# Altium project PCB_Project.PrjPcb (part 1 of 2)
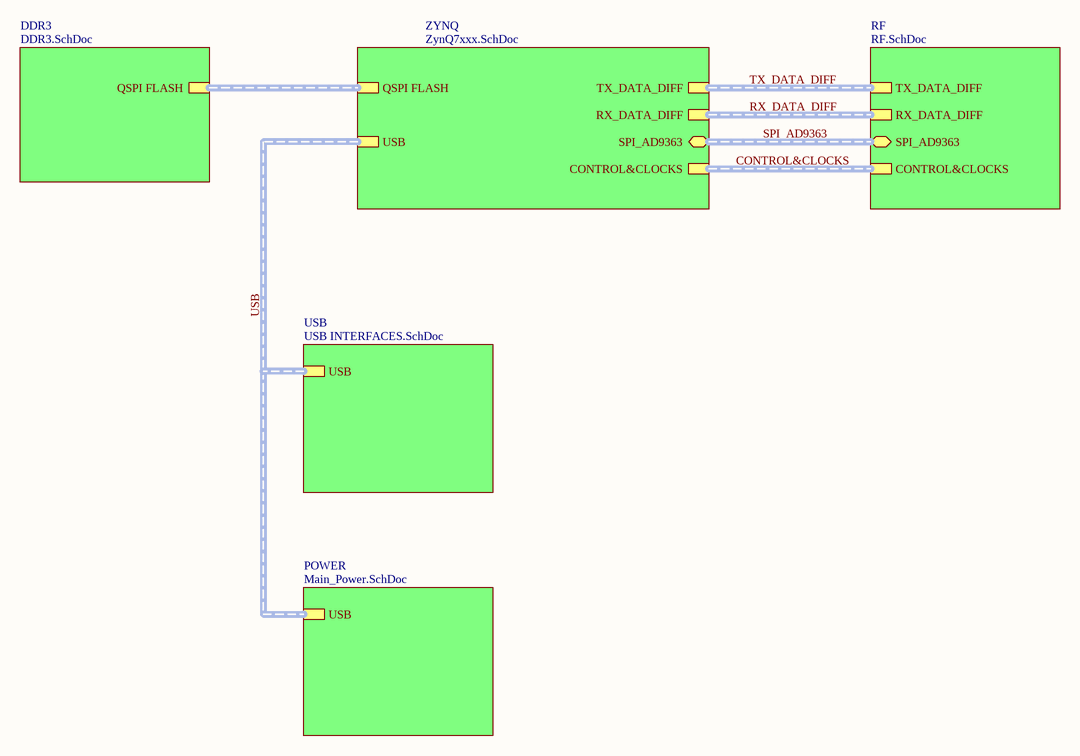
[diagram p0: TOP_Design.SchDoc]
6 sheets, 344 parts. Net scope: hierarchical (ports join the sheet entries above them; power ports are global).
Board file: SDR_CAMERA.PcbDoc
Sheets:
  TOP_Design.SchDoc
    ZYNQ = ZynQ7xxx.SchDoc
    DDR3 = DDR3.SchDoc
    RF = RF.SchDoc
    POWER = Main_Power.SchDoc
    USB = USB INTERFACES.SchDoc

## Sheet TOP_Design.SchDoc
size A4

### Sub-sheets
DDR3 = DDR3.SchDoc: QSPI FLASH (harness QSPI)
POWER = Main_Power.SchDoc: USB (harness QSPI)
RF = RF.SchDoc: TX_DATA_DIFF (harness TX_DATA), RX_DATA_DIFF (harness TX_DATA), SPI_AD9363 (bidir, harness SPI), CONTROL&CLOCKS (harness CONTROL&CLOCKS)
USB = USB INTERFACES.SchDoc: USB (harness QSPI)
ZYNQ = ZynQ7xxx.SchDoc: TX_DATA_DIFF (harness TX_DATA), RX_DATA_DIFF (harness TX_DATA), QSPI FLASH (harness QSPI), USB (harness QSPI), SPI_AD9363 (bidir, harness SPI), CONTROL&CLOCKS (harness CONTROL&CLOCKS)

### Buses and harness runs
harness CONTROL&CLOCKS = sheet RF/CONTROL&CLOCKS = sheet ZYNQ/CONTROL&CLOCKS
harness RX_DATA_DIFF = sheet RF/RX_DATA_DIFF = sheet ZYNQ/RX_DATA_DIFF
harness sheet DDR3/QSPI FLASH = sheet ZYNQ/QSPI FLASH
harness SPI_AD9363 = sheet RF/SPI_AD9363 = sheet ZYNQ/SPI_AD9363
harness TX_DATA_DIFF = sheet RF/TX_DATA_DIFF = sheet ZYNQ/TX_DATA_DIFF
harness USB = sheet POWER/USB = sheet USB/USB = sheet ZYNQ/USB

## Sheet ZynQ7xxx.SchDoc
size A1
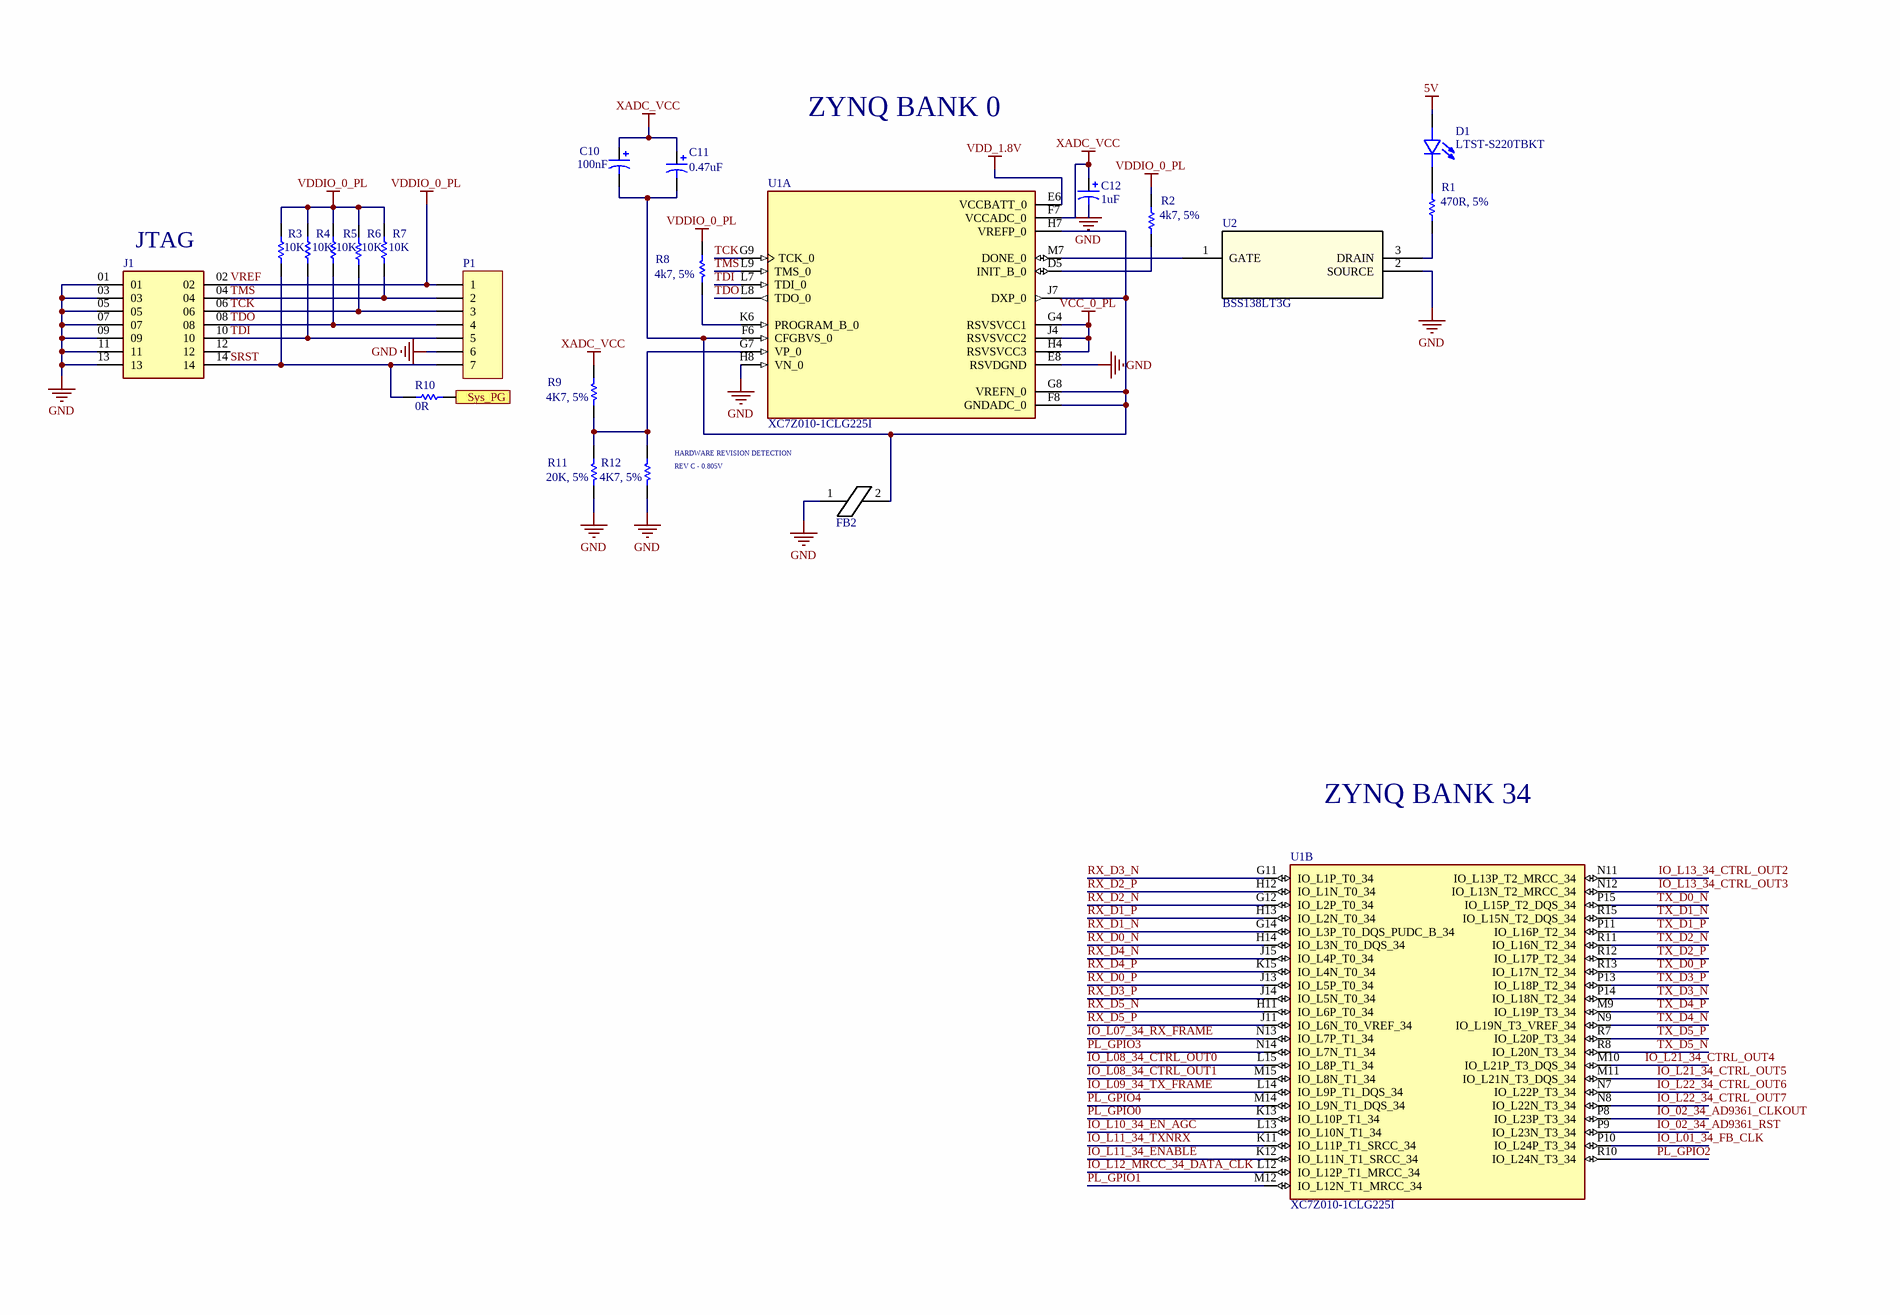
[diagram p1: ZynQ7xxx.SchDoc, top left]
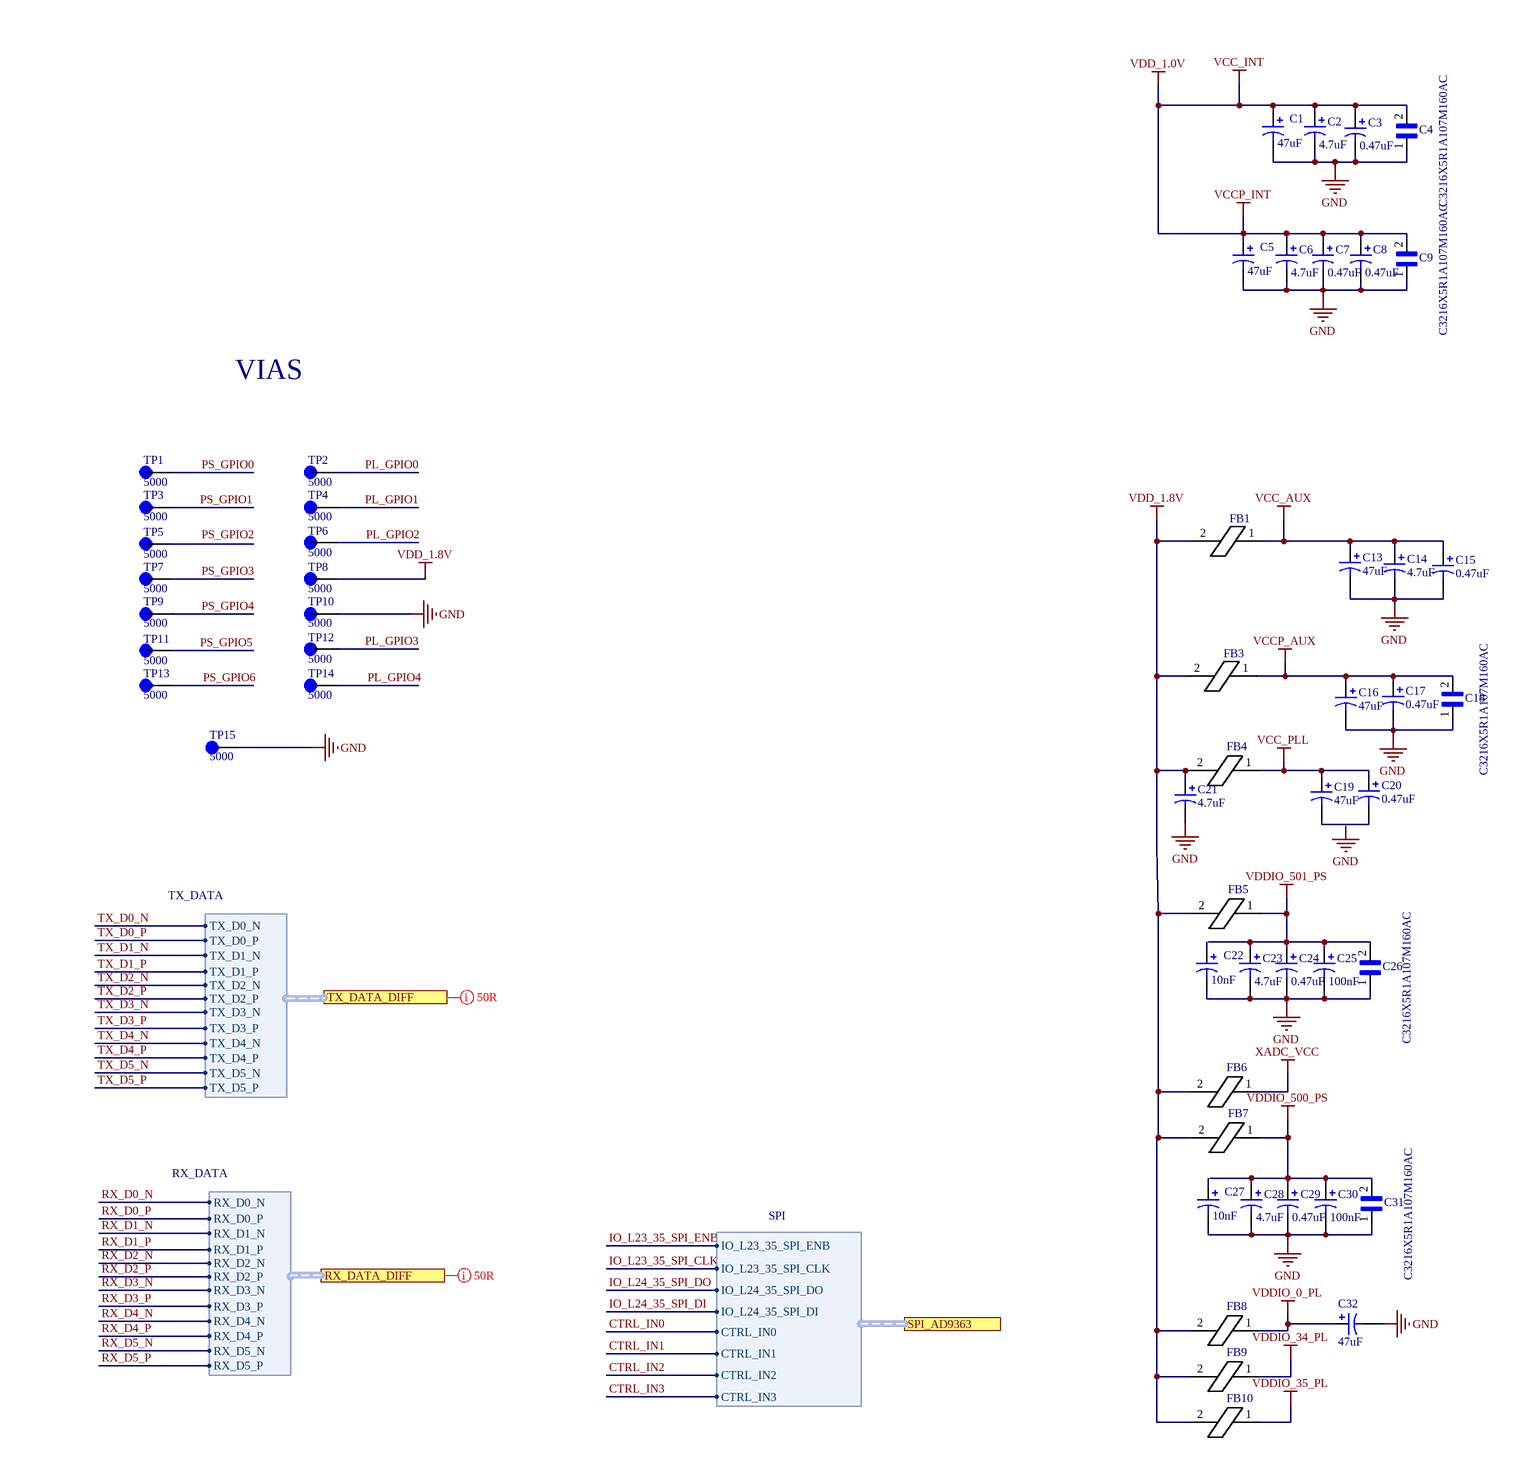
[diagram p2: ZynQ7xxx.SchDoc, top right]
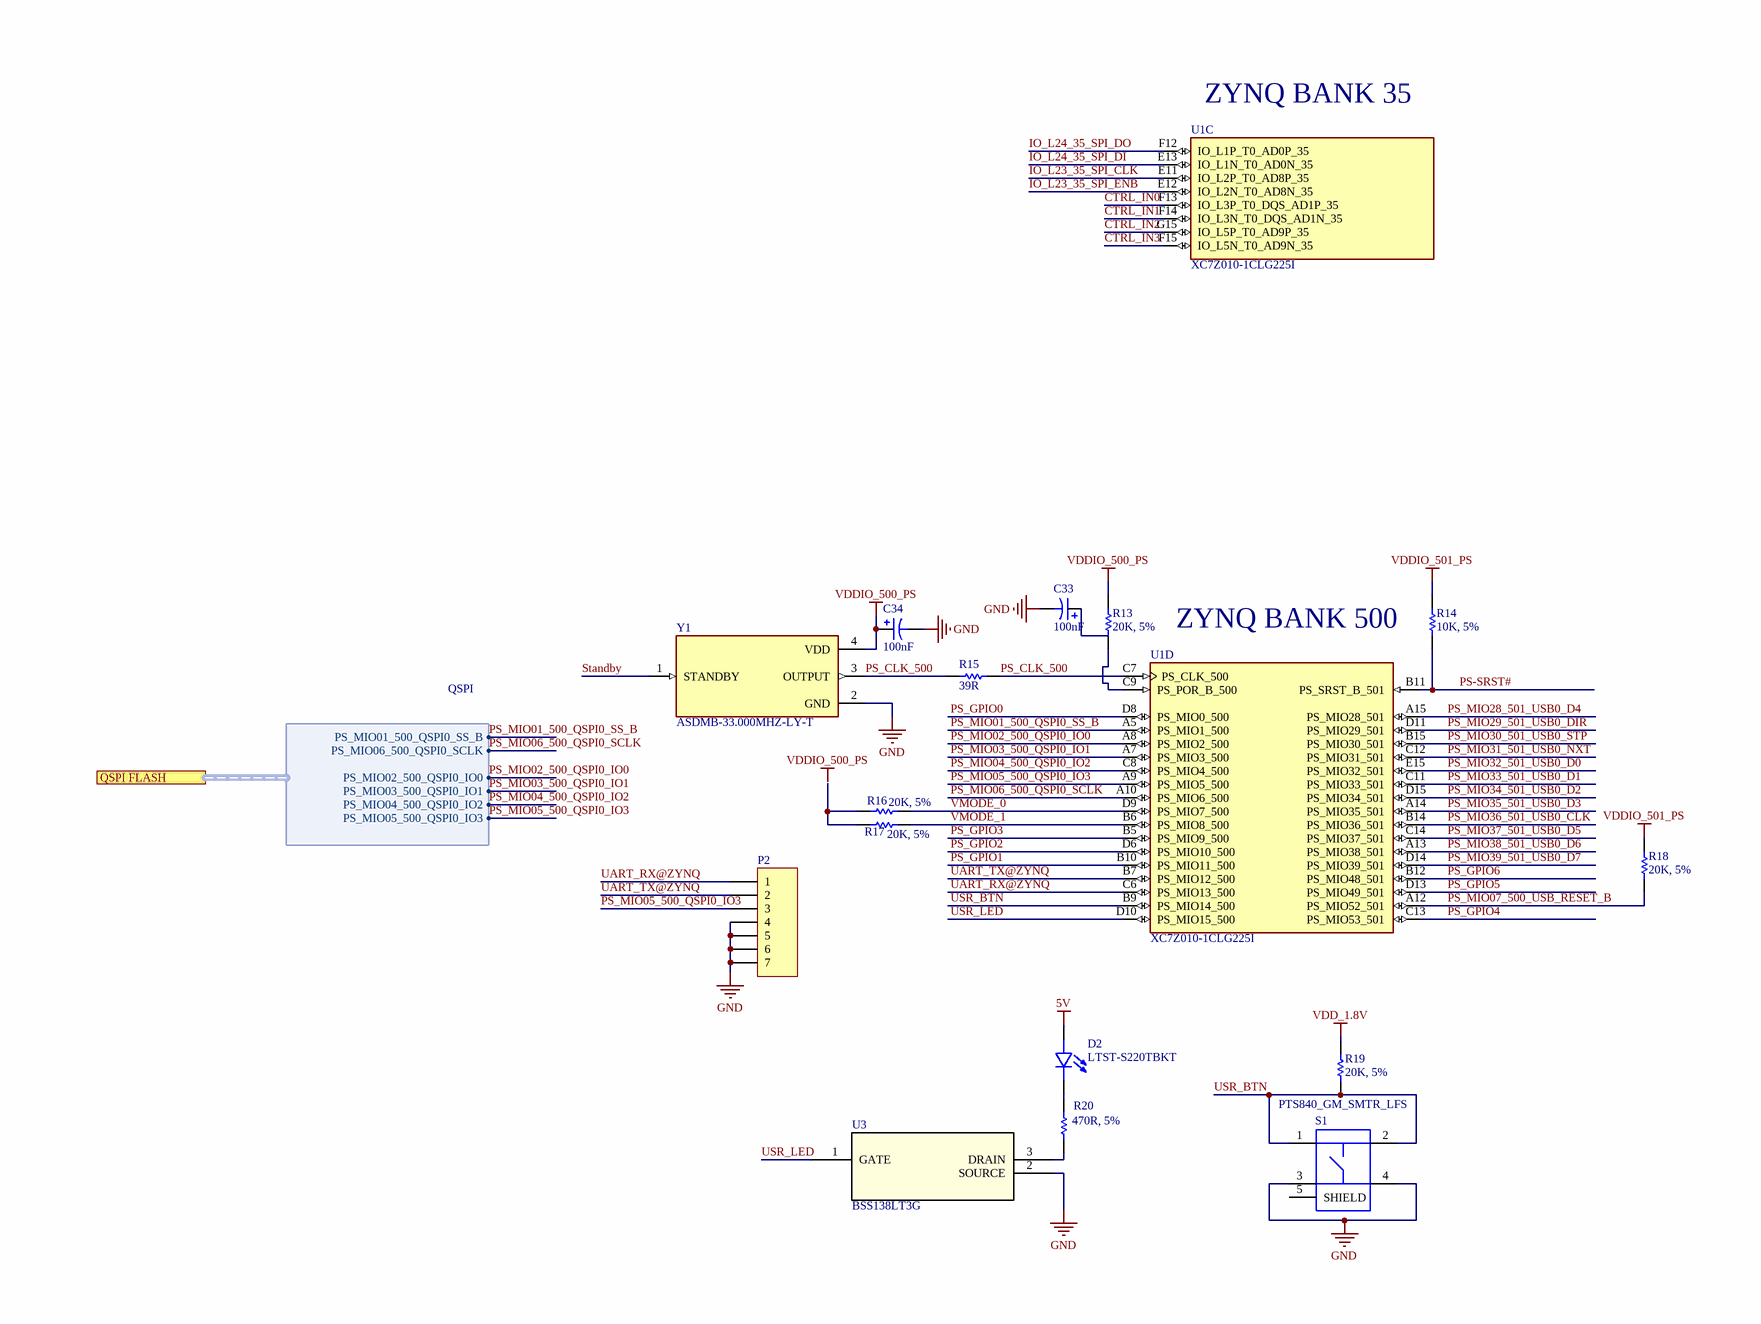
[diagram p3: ZynQ7xxx.SchDoc, bottom left]
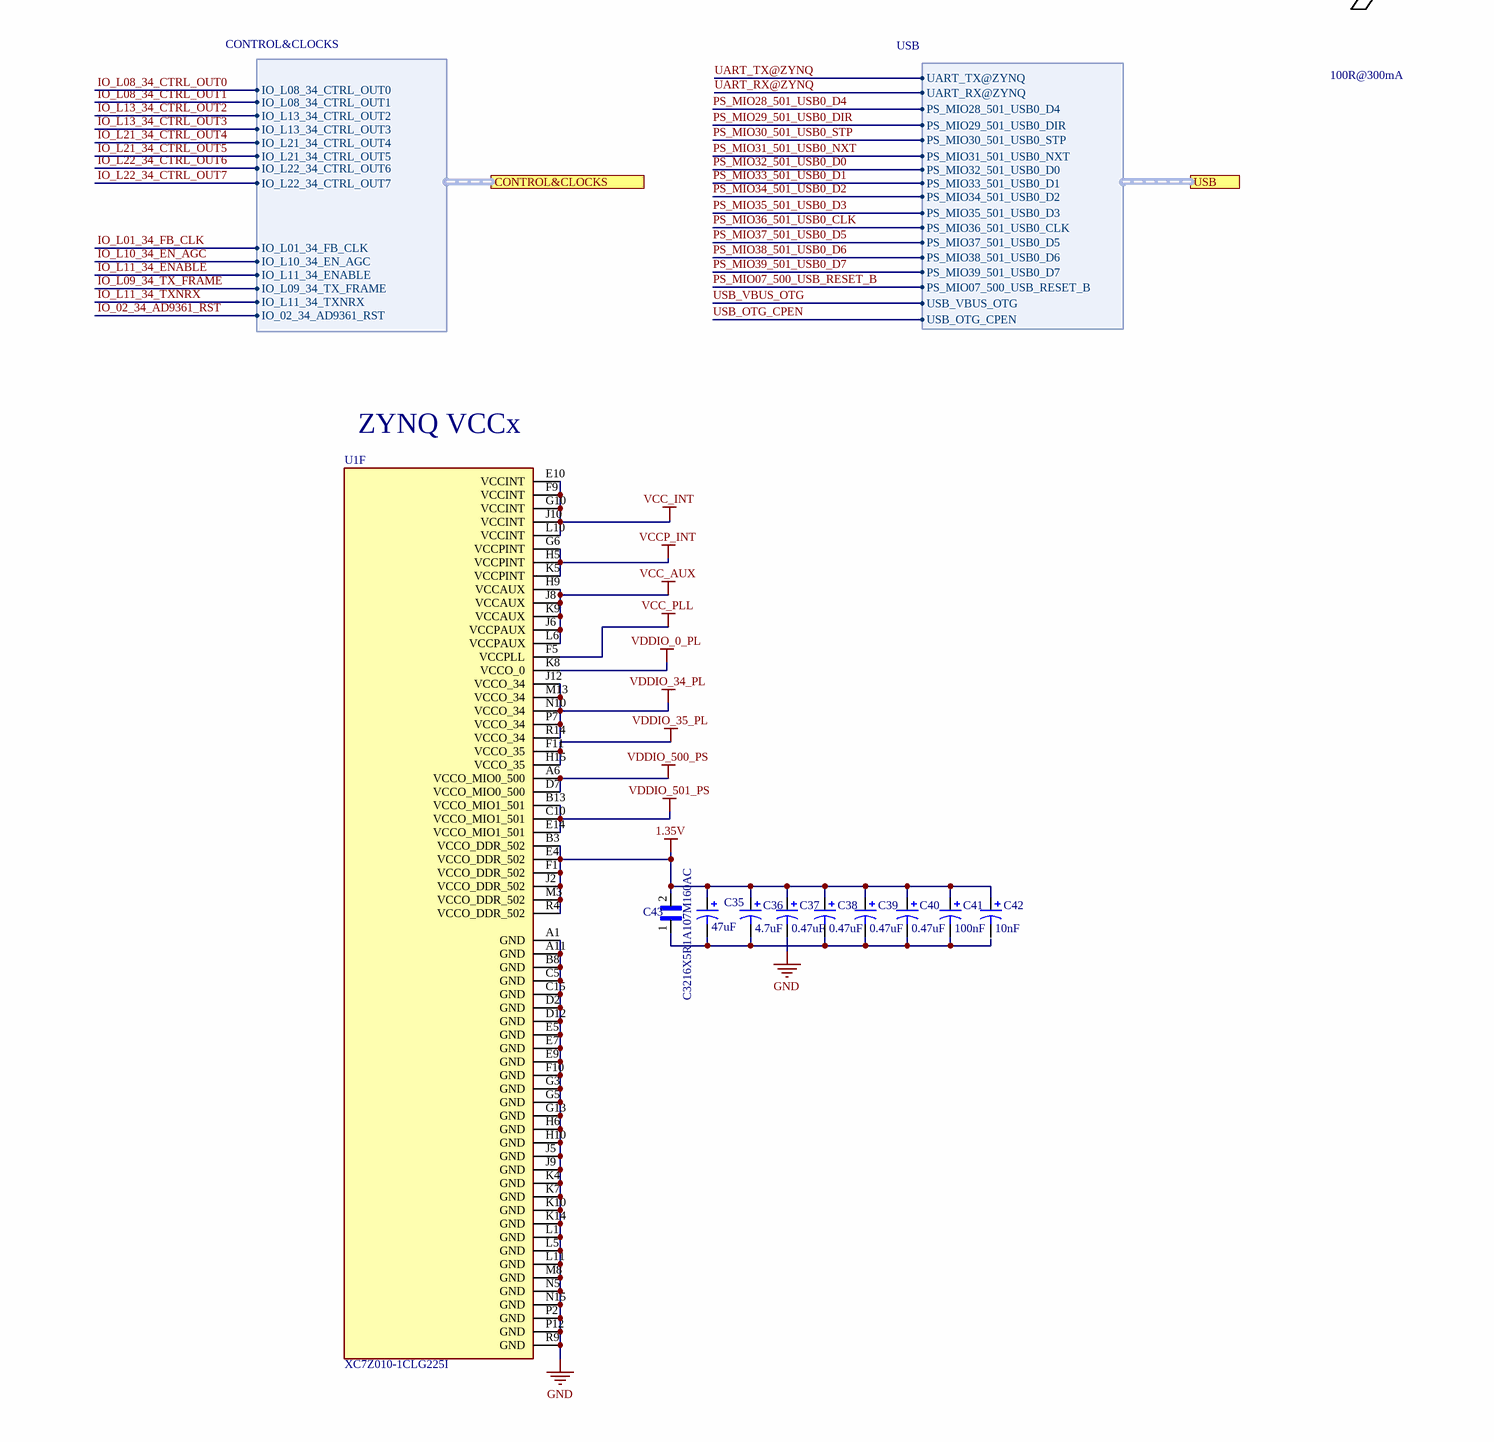
[diagram p4: ZynQ7xxx.SchDoc, bottom right]

### Parts
C1  value 47uF  [C0805]  (hidden comment: Cap Pol3)
C2  value 4.7uF  [C0805]  (hidden comment: Cap Pol3)
C3  value 0.47uF  [C0805]  (hidden comment: Cap Pol3)
C4  C3216X5R1A107M160AC  [CAPC3216X190N]
C5  value 47uF  [C0805]  (hidden comment: Cap Pol3)
C6  value 4.7uF  [C0805]  (hidden comment: Cap Pol3)
C7  value 0.47uF  [C0805]  (hidden comment: Cap Pol3)
C8  value 0.47uF  [C0805]  (hidden comment: Cap Pol3)
C9  C3216X5R1A107M160AC  [CAPC3216X190N]
C10  value 100nF  [C0805]  (hidden comment: Cap Pol3)
C11  value 0.47uF  [C0805]  (hidden comment: Cap Pol3)
C12  value 1uF  [C0805]  (hidden comment: Cap Pol3)
C13  value 47uF  [C0805]  (hidden comment: Cap Pol3)
C14  value 4.7uF  [C0805]  (hidden comment: Cap Pol3)
C15  value 0.47uF  [C0805]  (hidden comment: Cap Pol3)
C16  value 47uF  [C0805]  (hidden comment: Cap Pol3)
C17  value 0.47uF  [C0805]  (hidden comment: Cap Pol3)
C18  C3216X5R1A107M160AC  [CAPC3216X190N]
C19  value 47uF  [C0805]  (hidden comment: Cap Pol3)
C20  value 0.47uF  [C0805]  (hidden comment: Cap Pol3)
C21  value 4.7uF  [C0805]  (hidden comment: Cap Pol3)
C22  value 10nF  [C0805]  (hidden comment: Cap Pol3)
C23  value 4.7uF  [C0805]  (hidden comment: Cap Pol3)
C24  value 0.47uF  [C0805]  (hidden comment: Cap Pol3)
C25  value 100nF  [C0805]  (hidden comment: Cap Pol3)
C26  C3216X5R1A107M160AC  [CAPC3216X190N]
C27  value 10nF  [C0805]  (hidden comment: Cap Pol3)
C28  value 4.7uF  [C0805]  (hidden comment: Cap Pol3)
C29  value 0.47uF  [C0805]  (hidden comment: Cap Pol3)
C30  value 100nF  [C0805]  (hidden comment: Cap Pol3)
C31  C3216X5R1A107M160AC  [CAPC3216X190N]
C32  value 47uF  [C0805]  (hidden comment: Cap Pol3)
C33  value 100nF  [C0805]  (hidden comment: Cap Pol3)
C34  value 100nF  [C0805]  (hidden comment: Cap Pol3)
C35  value 47uF  [C0805]  (hidden comment: Cap Pol3)
C36  value 4.7uF  [C0805]  (hidden comment: Cap Pol3)
C37  value 0.47uF  [C0805]  (hidden comment: Cap Pol3)
C38  value 0.47uF  [C0805]  (hidden comment: Cap Pol3)
C39  value 0.47uF  [C0805]  (hidden comment: Cap Pol3)
C40  value 0.47uF  [C0805]  (hidden comment: Cap Pol3)
C41  value 100nF  [C0805]  (hidden comment: Cap Pol3)
C42  value 10nF  [C0805]  (hidden comment: Cap Pol3)
C43  C3216X5R1A107M160AC  [CAPC3216X190N]
D1  LTST-S220TBKT  [LED_LTST-S220TBKT]
D2  LTST-S220TBKT  [LED_LTST-S220TBKT]
FB1  FERRITA  [0805R]  (value not drawn)
FB2  FERRITA  [0805R]  (value not drawn)
FB3  FERRITA  [0805R]  (value not drawn)
FB4  FERRITA  [0805R]  (value not drawn)
FB5  FERRITA  [0805R]  (value not drawn)
FB6  FERRITA  [0805R]  (value not drawn)
FB7  FERRITA  [0805R]  (value not drawn)
FB8  FERRITA  [0805R]  (value not drawn)
FB9  FERRITA  [0805R]  (value not drawn)
FB10  FERRITA  [0805R]  (value not drawn)
J1  MTMM-107-03-G-D-190  [SAMTEC_MTMM-107-03-G-D-190]  (value not drawn)
P1  Header 7  [HDR1X7]  (value not drawn)
P2  Header 7  [HDR1X7]  (value not drawn)
R1  value 470R, 5%  [0603]  (hidden comment: Res1)
R2  value 4k7, 5%  [0603]  (hidden comment: Res1)
R3  value 10K  [0603]  (hidden comment: Res1)
R4  value 10K  [0603]  (hidden comment: Res1)
R5  value 10K  [0603]  (hidden comment: Res1)
R6  value 10K  [0603]  (hidden comment: Res1)
R7  value 10K  [0603]  (hidden comment: Res1)
R8  value 4k7, 5%  [0603]  (hidden comment: Res1)
R9  value 4K7, 5%  [0603]  (hidden comment: Res1)
R10  value 0R  [0603]  (hidden comment: Res1)
R11  value 20K, 5%  [0603]  (hidden comment: Res1)
R12  value 4K7, 5%  [0603]  (hidden comment: Res1)
R13  value 20K, 5%  [0603]  (hidden comment: Res1)
R14  value 10K, 5%  [0603]  (hidden comment: Res1)
R15  value 39R  [0603]  (hidden comment: Res1)
R16  value 20K, 5%  [0603]  (hidden comment: Res1)
R17  value 20K, 5%  [0603]  (hidden comment: Res1)
R18  value 20K, 5%  [0603]  (hidden comment: Res1)
R19  value 20K, 5%  [0603]  (hidden comment: Res1)
R20  value 470R, 5%  [0603]  (hidden comment: Res1)
S1  PTS840_GM_SMTR_LFS  [SW_PTS840GMSMTRLFS]
TP1  5000  [KEYSTONE_5000]
TP2  5000  [KEYSTONE_5000]
TP3  5000  [KEYSTONE_5000]
TP4  5000  [KEYSTONE_5000]
TP5  5000  [KEYSTONE_5000]
TP6  5000  [KEYSTONE_5000]
TP7  5000  [KEYSTONE_5000]
TP8  5000  [KEYSTONE_5000]
TP9  5000  [KEYSTONE_5000]
TP10  5000  [KEYSTONE_5000]
TP11  5000  [KEYSTONE_5000]
TP12  5000  [KEYSTONE_5000]
TP13  5000  [KEYSTONE_5000]
TP14  5000  [KEYSTONE_5000]
TP15  5000  [KEYSTONE_5000]
U1  XC7Z010-1CLG225I  [BGA225C80P15X15_1300X1300X150N]  (parts A,B,C,D,F of 6)
U2  BSS138LT3G  [SOT-23-3_1P4X3P040_ONS]
U3  BSS138LT3G  [SOT-23-3_1P4X3P040_ONS]
Y1  ASDMB-33.000MHZ-LY-T  [XTAL_ASDMB-33.000MHZ-LY-T]

### Ports
CONTROL&CLOCKS (harness CONTROL&CLOCKS), QSPI FLASH (harness QSPI), RX_DATA_DIFF (harness RX_DATA), SPI_AD9363 (harness SPI), Sys_PG, TX_DATA_DIFF (harness TX_DATA), USB (harness USB)

### Harnesses
TX_DATA: TX_D0_P, TX_D0_N, TX_D1_N, TX_D1_P, TX_D2_P, TX_D2_N, TX_D3_N, TX_D3_P, TX_D4_P, TX_D4_N, TX_D5_N, TX_D5_P
RX_DATA: RX_D0_P, RX_D0_N, RX_D1_N, RX_D1_P, RX_D2_P, RX_D2_N, RX_D3_N, RX_D3_P, RX_D4_P, RX_D5_N, RX_D5_P, RX_D4_N
SPI: IO_L24_35_SPI_DO, IO_L24_35_SPI_DI, IO_L23_35_SPI_CLK, IO_L23_35_SPI_ENB, CTRL_IN0, CTRL_IN1, CTRL_IN2, CTRL_IN3
CONTROL&CLOCKS: IO_L08_34_CTRL_OUT1, IO_L13_34_CTRL_OUT2, IO_L13_34_CTRL_OUT3, IO_L21_34_CTRL_OUT4, IO_L21_34_CTRL_OUT5, IO_L22_34_CTRL_OUT6, IO_L22_34_CTRL_OUT7, IO_L01_34_FB_CLK, IO_L10_34_EN_AGC, IO_L11_34_ENABLE, IO_L09_34_TX_FRAME, IO_L11_34_TXNRX, IO_02_34_AD9361_RST, IO_L08_34_CTRL_OUT0
QSPI: PS_MIO01_500_QSPI0_SS_B, PS_MIO06_500_QSPI0_SCLK, PS_MIO02_500_QSPI0_IO0, PS_MIO03_500_QSPI0_IO1, PS_MIO04_500_QSPI0_IO2, PS_MIO05_500_QSPI0_IO3
USB: PS_MIO29_501_USB0_DIR, PS_MIO28_501_USB0_D4, PS_MIO30_501_USB0_STP, PS_MIO31_501_USB0_NXT, PS_MIO33_501_USB0_D1, PS_MIO32_501_USB0_D0, PS_MIO34_501_USB0_D2, PS_MIO35_501_USB0_D3, PS_MIO37_501_USB0_D5, PS_MIO36_501_USB0_CLK, PS_MIO38_501_USB0_D6, PS_MIO39_501_USB0_D7, PS_MIO07_500_USB_RESET_B, USB_VBUS_OTG, USB_OTG_CPEN, UART_RX@ZYNQ, UART_TX@ZYNQ

### Nets
1.35V: C35.1 C36.1 C37.1 C38.1 C39.1 C40.1 C41.1 C42.1 C43.2 U1.B3(VCCO_DDR_502) U1.E4(VCCO_DDR_502) U1.F1(VCCO_DDR_502) U1.J2(VCCO_DDR_502) U1.M3(VCCO_DDR_502) U1.R4(VCCO_DDR_502)
5V: D1.A D2.A
GND: C1.2 C2.2 C3.2 C4.1 C5.2 C6.2 C7.2 C8.2 C9.1 C12.2 C13.2 C14.2 C15.2 C16.2 C17.2 C18.1 C21.2 C22.2 C23.2 C24.2 C25.2 C26.1 C27.2 C28.2 C29.2 C30.2 C31.1 C32.2 C33.2 C34.2 C37.2 FB2.1 J1.01 J1.03 J1.05 J1.07 J1.09 J1.11 J1.13 P1.6 P2.4 P2.5 P2.6 P2.7 R11.1 R12.1 S1.3 S1.4 TP10.TP TP15.TP U1.A1(GND) U1.A11(GND) U1.B8(GND) U1.C5(GND) U1.C15(GND) U1.D2(GND) U1.D12(GND) U1.E5(GND) U1.E7(GND) U1.E8(RSVDGND) U1.E9(GND) U1.F10(GND) U1.G3(GND) U1.G5(GND) U1.G13(GND) U1.H6(GND) U1.H8(VN_0) U1.H10(GND) U1.J5(GND) U1.J9(GND) U1.K4(GND) U1.K7(GND) U1.K10(GND) U1.K14(GND) U1.L1(GND) U1.L5(GND) U1.L11(GND) U1.M8(GND) U1.N5(GND) U1.N15(GND) U1.P2(GND) U1.P12(GND) U1.R9(GND) U2.2(SOURCE) U3.2(SOURCE) Y1.2(GND)
VCC_0_PL: U1.G4(RSVSVCC1) U1.H4(RSVSVCC3) U1.J4(RSVSVCC2)
VCC_AUX: C13.1 C14.1 C15.1 FB1.1 U1.H9(VCCAUX) U1.J6(VCCPAUX) U1.J8(VCCAUX) U1.K9(VCCAUX) U1.L6(VCCPAUX)
VCC_INT: C1.1 C2.1 C3.1 C4.2 C5.1 C6.1 C7.1 C8.1 C9.2 U1.E10(VCCINT) U1.F9(VCCINT) U1.G6(VCCPINT) U1.G10(VCCINT) U1.H5(VCCPINT) U1.J10(VCCINT) U1.K5(VCCPINT) U1.L10(VCCINT)  [also labelled VCCP_INT, VDD_1.0V]
VCC_PLL: C19.1 C20.1 FB4.1 U1.F5(VCCPLL)
VCCP_AUX: C16.1 C17.1 C18.2 FB3.1
VDD_1.8V: C21.1 FB1.2 FB3.2 FB4.2 FB5.2 FB6.2 FB7.2 FB8.2 FB9.2 FB10.2 R19.1 TP8.TP U1.E6(VCCBATT_0)
VDDIO_34_PL: FB9.1 U1.J12(VCCO_34) U1.M13(VCCO_34) U1.N10(VCCO_34) U1.P7(VCCO_34) U1.R14(VCCO_34)
VDDIO_35_PL: FB10.1 U1.F11(VCCO_35) U1.H15(VCCO_35)
VDDIO_500_PS: C28.1 C29.1 C30.1 C31.2 C34.1 FB7.1 R13.1 U1.A6(VCCO_MIO0_500) U1.D7(VCCO_MIO0_500) Y1.4(VDD)
VDDIO_501_PS: C23.1 C24.1 C25.1 C26.2 FB5.1 R14.1 R18.1 U1.B13(VCCO_MIO1_501) U1.C10(VCCO_MIO1_501) U1.E14(VCCO_MIO1_501)
VREF: C32.1 FB8.1 J1.02 P1.1 R2.2 R3.2 R4.2 R5.2 R6.2 R7.2 R8.2 U1.K8(VCCO_0)  [also labelled VDDIO_0_PL]
XADC_VCC: C10.1 C11.1 C12.1 FB6.1 R9.2 U1.F7(VCCADC_0)
CTRL_IN0: U1.F13(IO_L3P_T0_DQS_AD1P_35) ; port SPI_AD9363.CTRL_IN0
CTRL_IN1: U1.F14(IO_L3N_T0_DQS_AD1N_35) ; port SPI_AD9363.CTRL_IN1
CTRL_IN2: U1.G15(IO_L5P_T0_AD9P_35) ; port SPI_AD9363.CTRL_IN2
CTRL_IN3: U1.F15(IO_L5N_T0_AD9N_35) ; port SPI_AD9363.CTRL_IN3
IO_02_34_AD9361_CLKOUT: U1.P8(IO_L23P_T3_34)
IO_02_34_AD9361_RST: U1.P9(IO_L23N_T3_34) ; port CONTROL&CLOCKS.IO_02_34_AD9361_RST  [project net CONTROL&CLOCKS.IO_02_34_AD9361_RST]
IO_L01_34_FB_CLK: U1.P10(IO_L24P_T3_34) ; port CONTROL&CLOCKS.IO_L01_34_FB_CLK  [project net CONTROL&CLOCKS.IO_L01_34_FB_CLK]
IO_L07_34_RX_FRAME: U1.N13(IO_L7P_T1_34)
IO_L08_34_CTRL_OUT0: U1.L15(IO_L8P_T1_34) ; port CONTROL&CLOCKS.IO_L08_34_CTRL_OUT0  [project net CONTROL&CLOCKS.IO_L08_34_CTRL_OUT0]
IO_L08_34_CTRL_OUT1: U1.M15(IO_L8N_T1_34) ; port CONTROL&CLOCKS.IO_L08_34_CTRL_OUT1  [project net CONTROL&CLOCKS.IO_L08_34_CTRL_OUT1]
IO_L09_34_TX_FRAME: U1.L14(IO_L9P_T1_DQS_34) ; port CONTROL&CLOCKS.IO_L09_34_TX_FRAME  [project net CONTROL&CLOCKS.IO_L09_34_TX_FRAME]
IO_L10_34_EN_AGC: U1.L13(IO_L10N_T1_34) ; port CONTROL&CLOCKS.IO_L10_34_EN_AGC  [project net CONTROL&CLOCKS.IO_L10_34_EN_AGC]
IO_L11_34_ENABLE: U1.K12(IO_L11N_T1_SRCC_34) ; port CONTROL&CLOCKS.IO_L11_34_ENABLE  [project net CONTROL&CLOCKS.IO_L11_34_ENABLE]
IO_L11_34_TXNRX: U1.K11(IO_L11P_T1_SRCC_34) ; port CONTROL&CLOCKS.IO_L11_34_TXNRX  [project net CONTROL&CLOCKS.IO_L11_34_TXNRX]
IO_L12_MRCC_34_DATA_CLK: U1.L12(IO_L12P_T1_MRCC_34)
IO_L13_34_CTRL_OUT2: U1.N11(IO_L13P_T2_MRCC_34) ; port CONTROL&CLOCKS.IO_L13_34_CTRL_OUT2  [project net CONTROL&CLOCKS.IO_L13_34_CTRL_OUT2]
IO_L13_34_CTRL_OUT3: U1.N12(IO_L13N_T2_MRCC_34) ; port CONTROL&CLOCKS.IO_L13_34_CTRL_OUT3  [project net CONTROL&CLOCKS.IO_L13_34_CTRL_OUT3]
IO_L21_34_CTRL_OUT4: U1.M10(IO_L21P_T3_DQS_34) ; port CONTROL&CLOCKS.IO_L21_34_CTRL_OUT4  [project net CONTROL&CLOCKS.IO_L21_34_CTRL_OUT4]
IO_L21_34_CTRL_OUT5: U1.M11(IO_L21N_T3_DQS_34) ; port CONTROL&CLOCKS.IO_L21_34_CTRL_OUT5  [project net CONTROL&CLOCKS.IO_L21_34_CTRL_OUT5]
IO_L22_34_CTRL_OUT6: U1.N7(IO_L22P_T3_34) ; port CONTROL&CLOCKS.IO_L22_34_CTRL_OUT6  [project net CONTROL&CLOCKS.IO_L22_34_CTRL_OUT6]
IO_L22_34_CTRL_OUT7: U1.N8(IO_L22N_T3_34) ; port CONTROL&CLOCKS.IO_L22_34_CTRL_OUT7  [project net CONTROL&CLOCKS.IO_L22_34_CTRL_OUT7]
IO_L23_35_SPI_CLK: U1.E11(IO_L2P_T0_AD8P_35) ; port SPI_AD9363.IO_L23_35_SPI_CLK
IO_L23_35_SPI_ENB: U1.E12(IO_L2N_T0_AD8N_35) ; port SPI_AD9363.IO_L23_35_SPI_ENB
IO_L24_35_SPI_DI: U1.E13(IO_L1N_T0_AD0N_35) ; port SPI_AD9363.IO_L24_35_SPI_DI
IO_L24_35_SPI_DO: U1.F12(IO_L1P_T0_AD0P_35) ; port SPI_AD9363.IO_L24_35_SPI_DO
PL_GPIO0: TP2.TP U1.K13(IO_L10P_T1_34)
PL_GPIO1: TP4.TP U1.M12(IO_L12N_T1_MRCC_34)
PL_GPIO2: TP6.TP U1.R10(IO_L24N_T3_34)
PL_GPIO3: TP12.TP U1.N14(IO_L7N_T1_34)
PL_GPIO4: TP14.TP U1.M14(IO_L9N_T1_DQS_34)
PS-SRST#: R14.2 U1.B11(PS_SRST_B_501)
PS_CLK_500: R15.1 R15.2 U1.C7(PS_CLK_500) Y1.3(OUTPUT)
PS_GPIO0: TP1.TP U1.D8(PS_MIO0_500)
PS_GPIO1: TP3.TP U1.B10(PS_MIO11_500)
PS_GPIO2: U1.D6(PS_MIO10_500)
PS_GPIO3: TP7.TP U1.B5(PS_MIO9_500)
PS_GPIO4: TP9.TP U1.C13(PS_MIO53_501)
PS_GPIO5: TP11.TP U1.D13(PS_MIO49_501)
PS_GPIO6: TP13.TP U1.B12(PS_MIO48_501)
PS_MIO01_500_QSPI0_SS_B: U1.A5(PS_MIO1_500) ; port QSPI FLASH.PS_MIO01_500_QSPI0_SS_B
PS_MIO02_500_QSPI0_IO0: U1.A8(PS_MIO2_500) ; port QSPI FLASH.PS_MIO02_500_QSPI0_IO0
PS_MIO03_500_QSPI0_IO1: U1.A7(PS_MIO3_500) ; port QSPI FLASH.PS_MIO03_500_QSPI0_IO1
PS_MIO04_500_QSPI0_IO2: U1.C8(PS_MIO4_500) ; port QSPI FLASH.PS_MIO04_500_QSPI0_IO2
PS_MIO05_500_QSPI0_IO3: P2.3 U1.A9(PS_MIO5_500) ; port QSPI FLASH.PS_MIO05_500_QSPI0_IO3
PS_MIO06_500_QSPI0_SCLK: U1.A10(PS_MIO6_500) ; port QSPI FLASH.PS_MIO06_500_QSPI0_SCLK
PS_MIO07_500_USB_RESET_B: R18.2 U1.A12(PS_MIO52_501) ; port USB.PS_MIO07_500_USB_RESET_B
PS_MIO28_501_USB0_D4: U1.A15(PS_MIO28_501) ; port USB.PS_MIO28_501_USB0_D4
PS_MIO29_501_USB0_DIR: U1.D11(PS_MIO29_501) ; port USB.PS_MIO29_501_USB0_DIR
PS_MIO30_501_USB0_STP: U1.B15(PS_MIO30_501) ; port USB.PS_MIO30_501_USB0_STP
PS_MIO31_501_USB0_NXT: U1.C12(PS_MIO31_501) ; port USB.PS_MIO31_501_USB0_NXT
PS_MIO32_501_USB0_D0: U1.E15(PS_MIO32_501) ; port USB.PS_MIO32_501_USB0_D0
PS_MIO33_501_USB0_D1: U1.C11(PS_MIO33_501) ; port USB.PS_MIO33_501_USB0_D1
PS_MIO34_501_USB0_D2: U1.D15(PS_MIO34_501) ; port USB.PS_MIO34_501_USB0_D2
PS_MIO35_501_USB0_D3: U1.A14(PS_MIO35_501) ; port USB.PS_MIO35_501_USB0_D3
PS_MIO36_501_USB0_CLK: U1.B14(PS_MIO36_501) ; port USB.PS_MIO36_501_USB0_CLK
PS_MIO37_501_USB0_D5: U1.C14(PS_MIO37_501) ; port USB.PS_MIO37_501_USB0_D5
PS_MIO38_501_USB0_D6: U1.A13(PS_MIO38_501) ; port USB.PS_MIO38_501_USB0_D6
PS_MIO39_501_USB0_D7: U1.D14(PS_MIO39_501) ; port USB.PS_MIO39_501_USB0_D7
RX_D0_N: U1.H14(IO_L3N_T0_DQS_34) ; port RX_DATA_DIFF.RX_D0_N
RX_D0_P: U1.J13(IO_L5P_T0_34) ; port RX_DATA_DIFF.RX_D0_P
RX_D1_N: U1.G14(IO_L3P_T0_DQS_PUDC_B_34) ; port RX_DATA_DIFF.RX_D1_N
RX_D1_P: U1.H13(IO_L2N_T0_34) ; port RX_DATA_DIFF.RX_D1_P
RX_D2_N: U1.G12(IO_L2P_T0_34) ; port RX_DATA_DIFF.RX_D2_N
RX_D2_P: U1.H12(IO_L1N_T0_34) ; port RX_DATA_DIFF.RX_D2_P
RX_D3_N: U1.G11(IO_L1P_T0_34) ; port RX_DATA_DIFF.RX_D3_N
RX_D3_P: U1.J14(IO_L5N_T0_34) ; port RX_DATA_DIFF.RX_D3_P
RX_D4_N: U1.J15(IO_L4P_T0_34) ; port RX_DATA_DIFF.RX_D4_N
RX_D4_P: U1.K15(IO_L4N_T0_34) ; port RX_DATA_DIFF.RX_D4_P
RX_D5_N: U1.H11(IO_L6P_T0_34) ; port RX_DATA_DIFF.RX_D5_N
RX_D5_P: U1.J11(IO_L6N_T0_VREF_34) ; port RX_DATA_DIFF.RX_D5_P
SRST: J1.14 P1.7 R3.1 R10.2
Standby: Y1.1(STANDBY)
TCK: J1.06 P1.3 R6.1 U1.G9(TCK_0)
TDI: J1.10 P1.5 R4.1 U1.L7(TDI_0)
TDO: J1.08 P1.4 R5.1 U1.L8(TDO_0)
TMS: J1.04 P1.2 R7.1 U1.L9(TMS_0)
TX_D0_N: U1.P15(IO_L15P_T2_DQS_34) ; port TX_DATA_DIFF.TX_D0_N
TX_D0_P: U1.R13(IO_L17N_T2_34) ; port TX_DATA_DIFF.TX_D0_P
TX_D1_N: U1.R15(IO_L15N_T2_DQS_34) ; port TX_DATA_DIFF.TX_D1_N
TX_D1_P: U1.P11(IO_L16P_T2_34) ; port TX_DATA_DIFF.TX_D1_P
TX_D2_N: U1.R11(IO_L16N_T2_34) ; port TX_DATA_DIFF.TX_D2_N
TX_D2_P: U1.R12(IO_L17P_T2_34) ; port TX_DATA_DIFF.TX_D2_P
TX_D3_N: U1.P14(IO_L18N_T2_34) ; port TX_DATA_DIFF.TX_D3_N
TX_D3_P: U1.P13(IO_L18P_T2_34) ; port TX_DATA_DIFF.TX_D3_P
TX_D4_N: U1.N9(IO_L19N_T3_VREF_34) ; port TX_DATA_DIFF.TX_D4_N
TX_D4_P: U1.M9(IO_L19P_T3_34) ; port TX_DATA_DIFF.TX_D4_P
TX_D5_N: U1.R8(IO_L20N_T3_34) ; port TX_DATA_DIFF.TX_D5_N
TX_D5_P: U1.R7(IO_L20P_T3_34) ; port TX_DATA_DIFF.TX_D5_P
UART_RX@ZYNQ: P2.1 U1.C6(PS_MIO13_500) ; port USB.UART_RX@ZYNQ
UART_TX@ZYNQ: P2.2 U1.B7(PS_MIO12_500) ; port USB.UART_TX@ZYNQ
USR_BTN: R19.2 S1.1 S1.2 U1.B9(PS_MIO14_500)
USR_LED: U1.D10(PS_MIO15_500) U3.1(GATE)
VMODE_0: R16.2 U1.D9(PS_MIO7_500)
VMODE_1: R17.2 U1.B6(PS_MIO8_500)
NetC10_2: C10.2 C11.2 FB2.2 U1.F6(CFGBVS_0) U1.F8(GNDADC_0) U1.G8(VREFN_0) U1.H7(VREFP_0) U1.J7(DXP_0)
NetC19_2: C19.2 C20.2
NetC35_2: C35.2 C36.2 C38.2 C39.2 C40.2 C41.2 C43.1
NetD1_C: D1.C R1.2
NetD2_C: D2.C R20.2
NetR1_1: R1.1 U2.3(DRAIN)
NetR2_1: R2.1 U1.D5(INIT_B_0)
NetR8_1: R8.1 U1.K6(PROGRAM_B_0)
NetR9_1: R9.1 R11.2 R12.2 U1.G7(VP_0)
NetR10_1: R10.1 ; port Sys_PG
NetR13_2: R13.2 U1.C9(PS_POR_B_500)
NetR16_1: R16.1 R17.1
NetR20_1: R20.1 U3.3(DRAIN)
NetU1_M7: U1.M7(DONE_0) U2.1(GATE)

Not connected (* = marked no-connect by the designer): C22 1; C27 1; C33 1; C42 2; J1 12; S1 5(SHIELD); TP5 TP

### Layout directives
mark named 50R: (no net found under the mark)

### Notes on the sheet
- ZYNQ BANK 0
- (near J1) JTAG
- VIAS
- (near R12) HARDWARE REVISION DETECTION
- (near R12) REV C - 0.805V
- ZYNQ BANK 34
- 100R@300mA
- (near U1) ZYNQ BANK 35
- ZYNQ VCCx
- (near U1) ZYNQ BANK 500
- Labels drawn without touching a wire or pin: GND, PS_GPIO2, VDDIO_500_PS

### Library data of the parts
C1-C3 C5-C8 C10-C17 C19-C25 C27-C30 C32-C42 = Cap Pol3: Polarized Capacitor (Surface Mount); Published: 8-Jun-2000; LatestRevisionDate: 29-May-2009; LatestRevisionNote: IPC-7351 Footprint Added.; PackageReference: C0805; Publisher: Altium Limited; PackageDescription: Chip Capacitor
C4 C9 C18 C26 C31 C43 = C3216X5R1A107M160AC: 100 ÂµF Â±20% 10V Ceramic Capacitor X5R 1206 (3216 Metric); MF: TDK; Package: 3216 TDK; Digi-Key_Part_Number: 445-6007-1-ND; Check_prices: https://www.snapeda.com/parts/C3216X5R1A107M160AC/TDK/view-part/?ref=eda; Value: *; MP: C3216X5R1A107M160AC; SnapEDA_Link: https://www.snapeda.com/parts/C3216X5R1A107M160AC/TDK/view-part/?ref=snap; Purchase-URL: https://pricing.snapeda.com/search/part/C3216X5R1A107M160AC/?ref=eda
P1 P2 = Header 7: Header, 7-Pin; LatestRevisionDate: 17-Jul-2002; LatestRevisionNote: Re-released for DXP Platform.; Publisher: Altium Limited
R1-R20 = Res1_1: Resistor; Manufacturer: Generic Components; Class I: Passive; Published: 8-Jun-2000; Revision: July-2002: Re-released for DXP Platform.; Publisher: Altium Limited; Class II: Resistor; REF FARNELL 1206 SMD 510R: 4387065; REF FARNELL 1206 SMD 1K: 912475; REF FARNELL 1206 SMD 10K: 912591; REF FARNELL 0603 SMD: 612-595
S1 = PTS840_GM_SMTR_LFS: Tactile Switch SPST-NO Side Actuated Surface Mount, Right Angle; MP: PTS840 GM SMTR LFS; MF: C&K; Price: None; SnapEDA_Link: https://www.snapeda.com/parts/PTS840%20GM%20SMTR%20LFS/C&K/view-part/628485/?ref=snap; Availability: Unavailable; Value: *; Package: None
TP1-TP15 = 5000: Test Point Miniature THM H .300 Nylon 46 Insulated Red PhosBronze/Silver | Keystone Electronics 5000; SnapEDA_Link: https://www.snapeda.com/parts/5000/Keystone/view-part/?ref=snap; Package: Test Point Keystone Electronics; Value: *; MF: Keystone Electronics; MP: 5000; Check_prices: https://www.snapeda.com/parts/5000/Keystone/view-part/?ref=eda
U1 = XC7Z010-1CLG225I: Dual ARMÂ® CortexÂ®-A9 MPCoreâ„¢ with CoreSightâ„¢ System On Chip _SOC_ IC ZynqÂ®-7000 Artixâ„¢-7 FPGA, 28K Logic Cells 667MHz 225-CSPBGA _13x13_; MF: Xilinx Inc.; Price: None; Availability: Unavailable; SnapEDA_Link: https://www.snapeda.com/parts/XC7Z010-1CLG225I/Xilinx%20Inc./view-part/1219501/?ref=snap; Value: *; Package: CSPBGA-225 Xilinx; MP: XC7Z010-1CLG225I
U2 U3 = BSS138LT3G: No Description Available; Mfr_Name: onsemi; RefDes: RefDes; Type: Type
D1 D2 = LTST-S220TBKT: Package: None; Price: None; Value: *; MP: LTST-S220TBKT; Availability: Unavailable
FB1-FB10 = FERRITA: CODIGO DIGIKEY: *; CODIGO FARNELL: *; CODIGO MOUSER: *; CODIGO PRODUCTO: *; DISTRIBUIDOR 1: *; DISTRIBUIDOR 2: *
J1 = MTMM-107-03-G-D-190: Price: None; Availability: Unavailable; MP: MTMM-107-03-G-D-190; Value: *; Package: None
Y1 = ASDMB-33.000MHZ-LY-T: Price: None; MP: ASDMB-33.000MHZ-LY-T; Availability: Unavailable; Value: *; Package: None

## Sheet DDR3.SchDoc
size A2
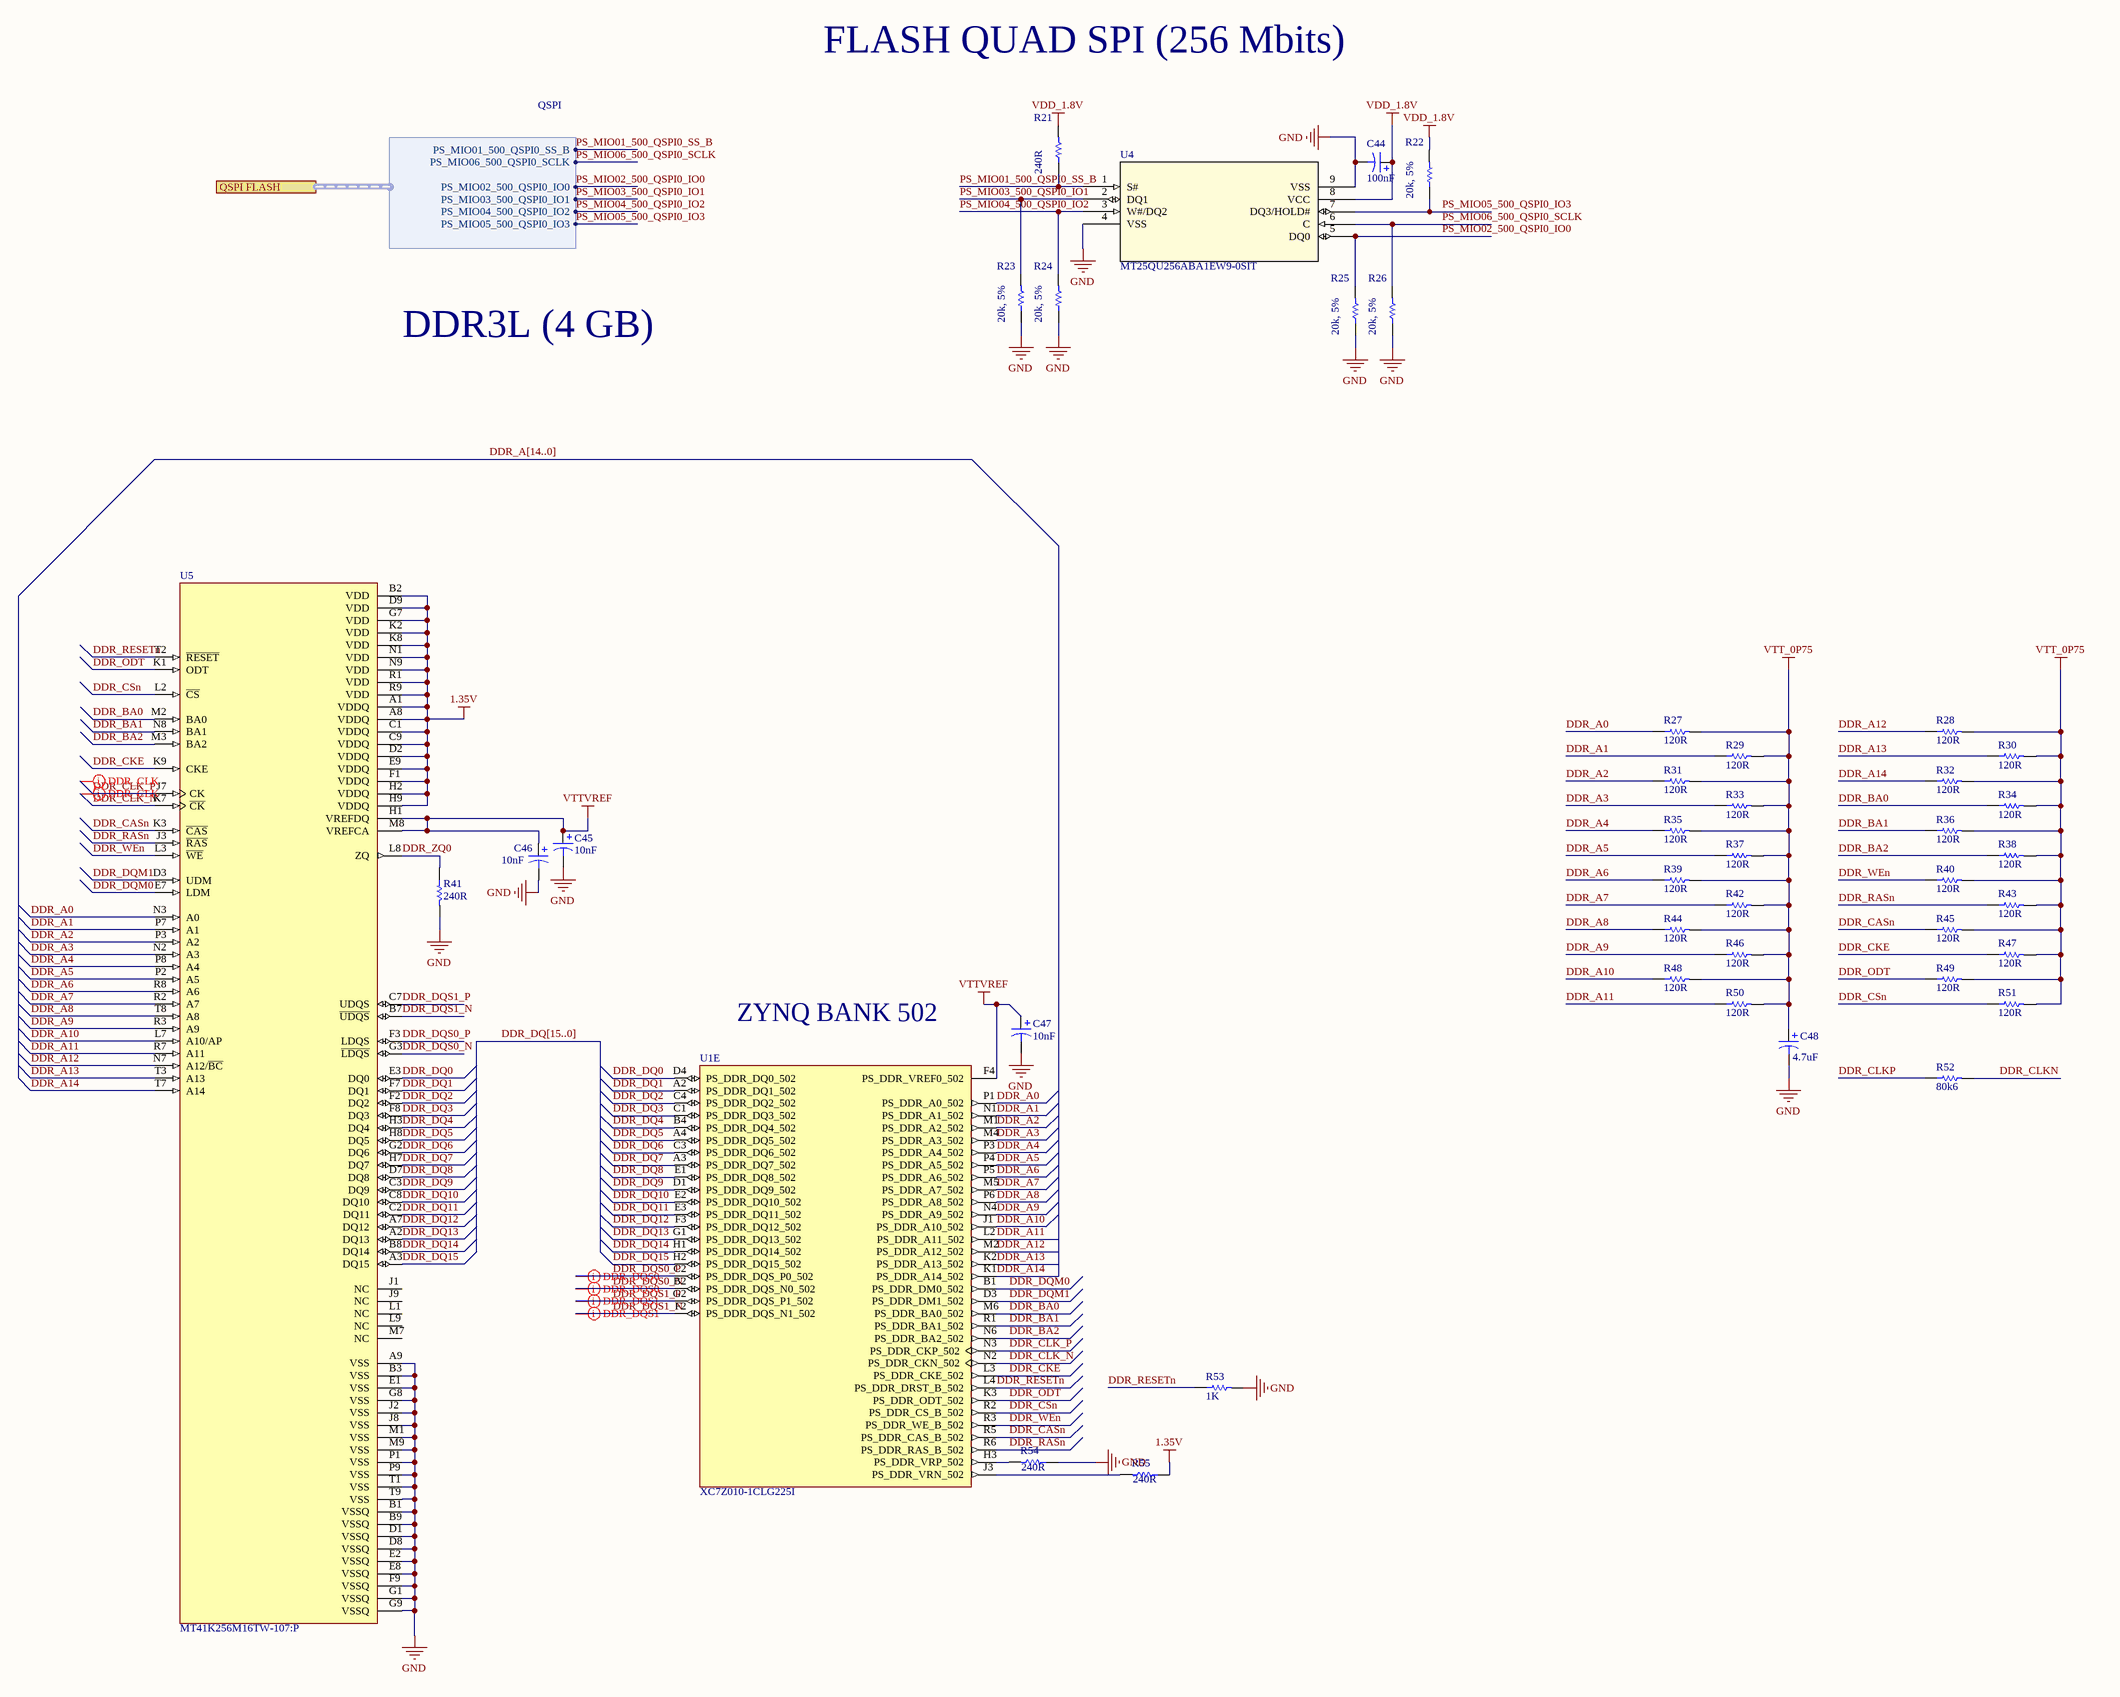
[diagram p5: DDR3.SchDoc]

### Parts
C44  value 100nF  [C0805]  (hidden comment: Cap Pol3)
C45  value 10nF  [C0805]  (hidden comment: Cap Pol3)
C46  value 10nF  [C0805]  (hidden comment: Cap Pol3)
C47  value 10nF  [C0805]  (hidden comment: Cap Pol3)
C48  value 4.7uF  [C0805]  (hidden comment: Cap Pol3)
R21  value 240R  [0603]  (hidden comment: Res1)
R22  value 20k, 5%  [0603]  (hidden comment: Res1)
R23  value 20k, 5%  [0603]  (hidden comment: Res1)
R24  value 20k, 5%  [0603]  (hidden comment: Res1)
R25  value 20k, 5%  [0603]  (hidden comment: Res1)
R26  value 20k, 5%  [0603]  (hidden comment: Res1)
R27  value 120R  [0603]  (hidden comment: Res1)
R28  value 120R  [0603]  (hidden comment: Res1)
R29  value 120R  [0603]  (hidden comment: Res1)
R30  value 120R  [0603]  (hidden comment: Res1)
R31  value 120R  [0603]  (hidden comment: Res1)
R32  value 120R  [0603]  (hidden comment: Res1)
R33  value 120R  [0603]  (hidden comment: Res1)
R34  value 120R  [0603]  (hidden comment: Res1)
R35  value 120R  [0603]  (hidden comment: Res1)
R36  value 120R  [0603]  (hidden comment: Res1)
R37  value 120R  [0603]  (hidden comment: Res1)
R38  value 120R  [0603]  (hidden comment: Res1)
R39  value 120R  [0603]  (hidden comment: Res1)
R40  value 120R  [0603]  (hidden comment: Res1)
R41  value 240R  [0603]  (hidden comment: Res1)
R42  value 120R  [0603]  (hidden comment: Res1)
R43  value 120R  [0603]  (hidden comment: Res1)
R44  value 120R  [0603]  (hidden comment: Res1)
R45  value 120R  [0603]  (hidden comment: Res1)
R46  value 120R  [0603]  (hidden comment: Res1)
R47  value 120R  [0603]  (hidden comment: Res1)
R48  value 120R  [0603]  (hidden comment: Res1)
R49  value 120R  [0603]  (hidden comment: Res1)
R50  value 120R  [0603]  (hidden comment: Res1)
R51  value 120R  [0603]  (hidden comment: Res1)
R52  value 80k6  [0603]  (hidden comment: Res1)
R53  value 1K  [0603]  (hidden comment: Res1)
R54  value 240R  [0603]  (hidden comment: Res1)
R55  value 240R  [0603]  (hidden comment: Res1)
U1  XC7Z010-1CLG225I  [BGA225C80P15X15_1300X1300X150N]  (part E of 6)
U4  MT25QU256ABA1EW9-0SIT  [W-PDFN-8MLP8_8X6_MRN]
U5  MT41K256M16TW-107:P  [BGA96C80P9X16_1400X800X120]

### Ports
QSPI FLASH (harness QSPI)

### Harnesses
QSPI: PS_MIO01_500_QSPI0_SS_B, PS_MIO06_500_QSPI0_SCLK, PS_MIO02_500_QSPI0_IO0, PS_MIO03_500_QSPI0_IO1, PS_MIO04_500_QSPI0_IO2, PS_MIO05_500_QSPI0_IO3

### Nets
1.35V: R55.1 U5.A1(VDDQ) U5.A8(VDDQ) U5.B2(VDD) U5.C1(VDDQ) U5.C9(VDDQ) U5.D2(VDDQ) U5.D9(VDD) U5.E9(VDDQ) U5.F1(VDDQ) U5.G7(VDD) U5.H2(VDDQ) U5.H9(VDDQ) U5.K2(VDD) U5.K8(VDD) U5.N1(VDD) U5.N9(VDD) U5.R1(VDD) U5.R9(VDD)
GND: C44.2 C45.2 C46.2 C47.2 C48.2 R23.1 R24.1 R25.1 R26.1 R41.2 R53.2 R54.1 U4.4(VSS) U4.9(VSS) U5.A9(VSS) U5.B1(VSSQ) U5.B3(VSS) U5.B9(VSSQ) U5.D1(VSSQ) U5.D8(VSSQ) U5.E1(VSS) U5.E2(VSSQ) U5.E8(VSSQ) U5.F9(VSSQ) U5.G1(VSSQ) U5.G8(VSS) U5.G9(VSSQ) U5.J2(VSS) U5.J8(VSS) U5.M1(VSS) U5.M9(VSS) U5.P1(VSS) U5.P9(VSS) U5.T1(VSS) U5.T9(VSS)
VDD_1.8V: C44.1 R21.2 R22.2 U4.8(VCC)
VTT_0P75: C48.1 R27.2 R28.2 R29.2 R30.2 R31.2 R32.2 R33.2 R34.2 R35.2 R36.2 R37.2 R38.2 R39.2 R40.2 R42.2 R43.2 R44.2 R45.2 R46.2 R47.2 R48.2 R49.2 R50.2 R51.2
VTTVREF: C45.1 C46.1 C47.1 U1.F4(PS_DDR_VREF0_502) U5.H1(VREFDQ) U5.M8(VREFCA)
DDR_A0: R27.1 U1.P1(PS_DDR_A0_502) U5.N3(A0)
DDR_A1: R29.1 U1.N1(PS_DDR_A1_502) U5.P7(A1)
DDR_A2: R31.1 U1.M1(PS_DDR_A2_502) U5.P3(A2)
DDR_A3: R33.1 U1.M4(PS_DDR_A3_502) U5.N2(A3)
DDR_A4: R35.1 U1.P3(PS_DDR_A4_502) U5.P8(A4)
DDR_A5: R37.1 U1.P4(PS_DDR_A5_502) U5.P2(A5)
DDR_A6: R39.1 U1.P5(PS_DDR_A6_502) U5.R8(A6)
DDR_A7: R42.1 U1.M5(PS_DDR_A7_502) U5.R2(A7)
DDR_A8: R44.1 U1.P6(PS_DDR_A8_502) U5.T8(A8)
DDR_A9: R46.1 U1.N4(PS_DDR_A9_502) U5.R3(A9)
DDR_A10: R48.1 U1.J1(PS_DDR_A10_502) U5.L7(A10/AP)
DDR_A11: R50.1 U1.L2(PS_DDR_A11_502) U5.R7(A11)
DDR_A12: R28.1 U1.M2(PS_DDR_A12_502) U5.N7(A12/~{BC})
DDR_A13: R30.1 U1.K2(PS_DDR_A13_502) U5.T3(A13)
DDR_A14: R32.1 U1.K1(PS_DDR_A14_502) U5.T7(A14)
DDR_BA0: R34.1 U1.M6(PS_DDR_BA0_502) U5.M2(BA0)
DDR_BA1: R36.1 U1.R1(PS_DDR_BA1_502) U5.N8(BA1)
DDR_BA2: R38.1 U1.N6(PS_DDR_BA2_502) U5.M3(BA2)
DDR_CASn: R45.1 U1.R5(PS_DDR_CAS_B_502) U5.K3(~{CAS})
DDR_CKE: R47.1 U1.L3(PS_DDR_CKE_502) U5.K9(CKE)
DDR_CLK_N: U1.N2(PS_DDR_CKN_502) U5.K7(~{CK})
DDR_CLK_P: U1.N3(PS_DDR_CKP_502) U5.J7(CK)
DDR_CLKN: R52.2
DDR_CLKP: R52.1
DDR_CSn: R51.1 U1.R2(PS_DDR_CS_B_502) U5.L2(~{CS})
DDR_DQ0: U1.D4(PS_DDR_DQ0_502) U5.E3(DQ0)
DDR_DQ1: U1.A2(PS_DDR_DQ1_502) U5.F7(DQ1)
DDR_DQ2: U1.C4(PS_DDR_DQ2_502) U5.F2(DQ2)
DDR_DQ3: U1.C1(PS_DDR_DQ3_502) U5.F8(DQ3)
DDR_DQ4: U1.B4(PS_DDR_DQ4_502) U5.H3(DQ4)
DDR_DQ5: U1.A4(PS_DDR_DQ5_502) U5.H8(DQ5)
DDR_DQ6: U1.C3(PS_DDR_DQ6_502) U5.G2(DQ6)
DDR_DQ7: U1.A3(PS_DDR_DQ7_502) U5.H7(DQ7)
DDR_DQ8: U1.E1(PS_DDR_DQ8_502) U5.D7(DQ8)
DDR_DQ9: U1.D1(PS_DDR_DQ9_502) U5.C3(DQ9)
DDR_DQ10: U1.E2(PS_DDR_DQ10_502) U5.C8(DQ10)
DDR_DQ11: U1.E3(PS_DDR_DQ11_502) U5.C2(DQ11)
DDR_DQ12: U1.F3(PS_DDR_DQ12_502) U5.A7(DQ12)
DDR_DQ13: U1.G1(PS_DDR_DQ13_502) U5.A2(DQ13)
DDR_DQ14: U1.H1(PS_DDR_DQ14_502) U5.B8(DQ14)
DDR_DQ15: U1.H2(PS_DDR_DQ15_502) U5.A3(DQ15)
DDR_DQM0: U1.B1(PS_DDR_DM0_502) U5.E7(LDM)
DDR_DQM1: U1.D3(PS_DDR_DM1_502) U5.D3(UDM)
DDR_DQS0_N: U1.B2(PS_DDR_DQS_N0_502) U5.G3(~{LDQS})
DDR_DQS0_P: U1.C2(PS_DDR_DQS_P0_502) U5.F3(LDQS)
DDR_DQS1_N: U1.F2(PS_DDR_DQS_N1_502) U5.B7(~{UDQS})
DDR_DQS1_P: U1.G2(PS_DDR_DQS_P1_502) U5.C7(UDQS)
DDR_ODT: R49.1 U1.K3(PS_DDR_ODT_502) U5.K1(ODT)
DDR_RASn: R43.1 U1.R6(PS_DDR_RAS_B_502) U5.J3(~{RAS})
DDR_RESETn: R53.1 U1.L4(PS_DDR_DRST_B_502) U5.T2(~{RESET})
DDR_WEn: R40.1 U1.R3(PS_DDR_WE_B_502) U5.L3(~{WE})
DDR_ZQ0: R41.1 U5.L8(ZQ)
PS_MIO01_500_QSPI0_SS_B: R21.1 U4.1(S#) ; port QSPI FLASH.PS_MIO01_500_QSPI0_SS_B
PS_MIO02_500_QSPI0_IO0: R25.2 U4.5(DQ0) ; port QSPI FLASH.PS_MIO02_500_QSPI0_IO0
PS_MIO03_500_QSPI0_IO1: R23.2 U4.2(DQ1) ; port QSPI FLASH.PS_MIO03_500_QSPI0_IO1
PS_MIO04_500_QSPI0_IO2: R24.2 U4.3(W#/DQ2) ; port QSPI FLASH.PS_MIO04_500_QSPI0_IO2
PS_MIO05_500_QSPI0_IO3: R22.1 U4.7(DQ3/HOLD#) ; port QSPI FLASH.PS_MIO05_500_QSPI0_IO3
PS_MIO06_500_QSPI0_SCLK: R26.2 U4.6(C) ; port QSPI FLASH.PS_MIO06_500_QSPI0_SCLK
NetR54_2: R54.2 U1.H3(PS_DDR_VRP_502)
NetR55_2: R55.2 U1.J3(PS_DDR_VRN_502)

Not connected (* = marked no-connect by the designer): U5 J1(NC) J9(NC) L1(NC) L9(NC) M7(NC)

### Buses and harness runs
bus DDR_A[14..0]
bus DDR_DQ[15..0]

### Layout directives
differential pair: DDR_CLK_N, DDR_CLK_P, DDR_DQS0_N, DDR_DQS0_P, DDR_DQS1_N, DDR_DQS1_P

### Notes on the sheet
- FLASH QUAD SPI (256 Mbits)
- DDR3L (4 GB)
- ZYNQ BANK 502

### Library data of the parts
C44-C48 = Cap Pol3: Polarized Capacitor (Surface Mount); Published: 8-Jun-2000; LatestRevisionDate: 29-May-2009; LatestRevisionNote: IPC-7351 Footprint Added.; PackageReference: C0805; Publisher: Altium Limited; PackageDescription: Chip Capacitor
R21-R55 = Res1_1: as R1 on sheet ZynQ7xxx; Published: 8-Jun-2000; Revision: July-2002: Re-released for DXP Platform.; Publisher: Altium Limited; Class II: Resistor; REF FARNELL 1206 SMD 510R: 4387065; REF FARNELL 1206 SMD 1K: 912475; REF FARNELL 1206 SMD 10K: 912591; REF FARNELL 0603 SMD: 612-595
U1 = XC7Z010-1CLG225I: as U1 on sheet ZynQ7xxx; Price: None; Availability: Unavailable; SnapEDA_Link: https://www.snapeda.com/parts/XC7Z010-1CLG225I/Xilinx%20Inc./view-part/1219501/?ref=snap; Value: *; Package: CSPBGA-225 Xilinx; MP: XC7Z010-1CLG225I
U4 = MT25QU256ABA1EW9-0SIT: No Description Available; Mfr_Name: Micron; RefDes: RefDes; Type: Type
U5 = MT41K256M16TW-107:P: MF: {'manufacturer': u'Micron Technology Inc.'}; Package: None; Price: None; Value: *; MP: MT41K256M16TW-107:P; Availability: Unavailable

## Sheet RF.SchDoc
size A2
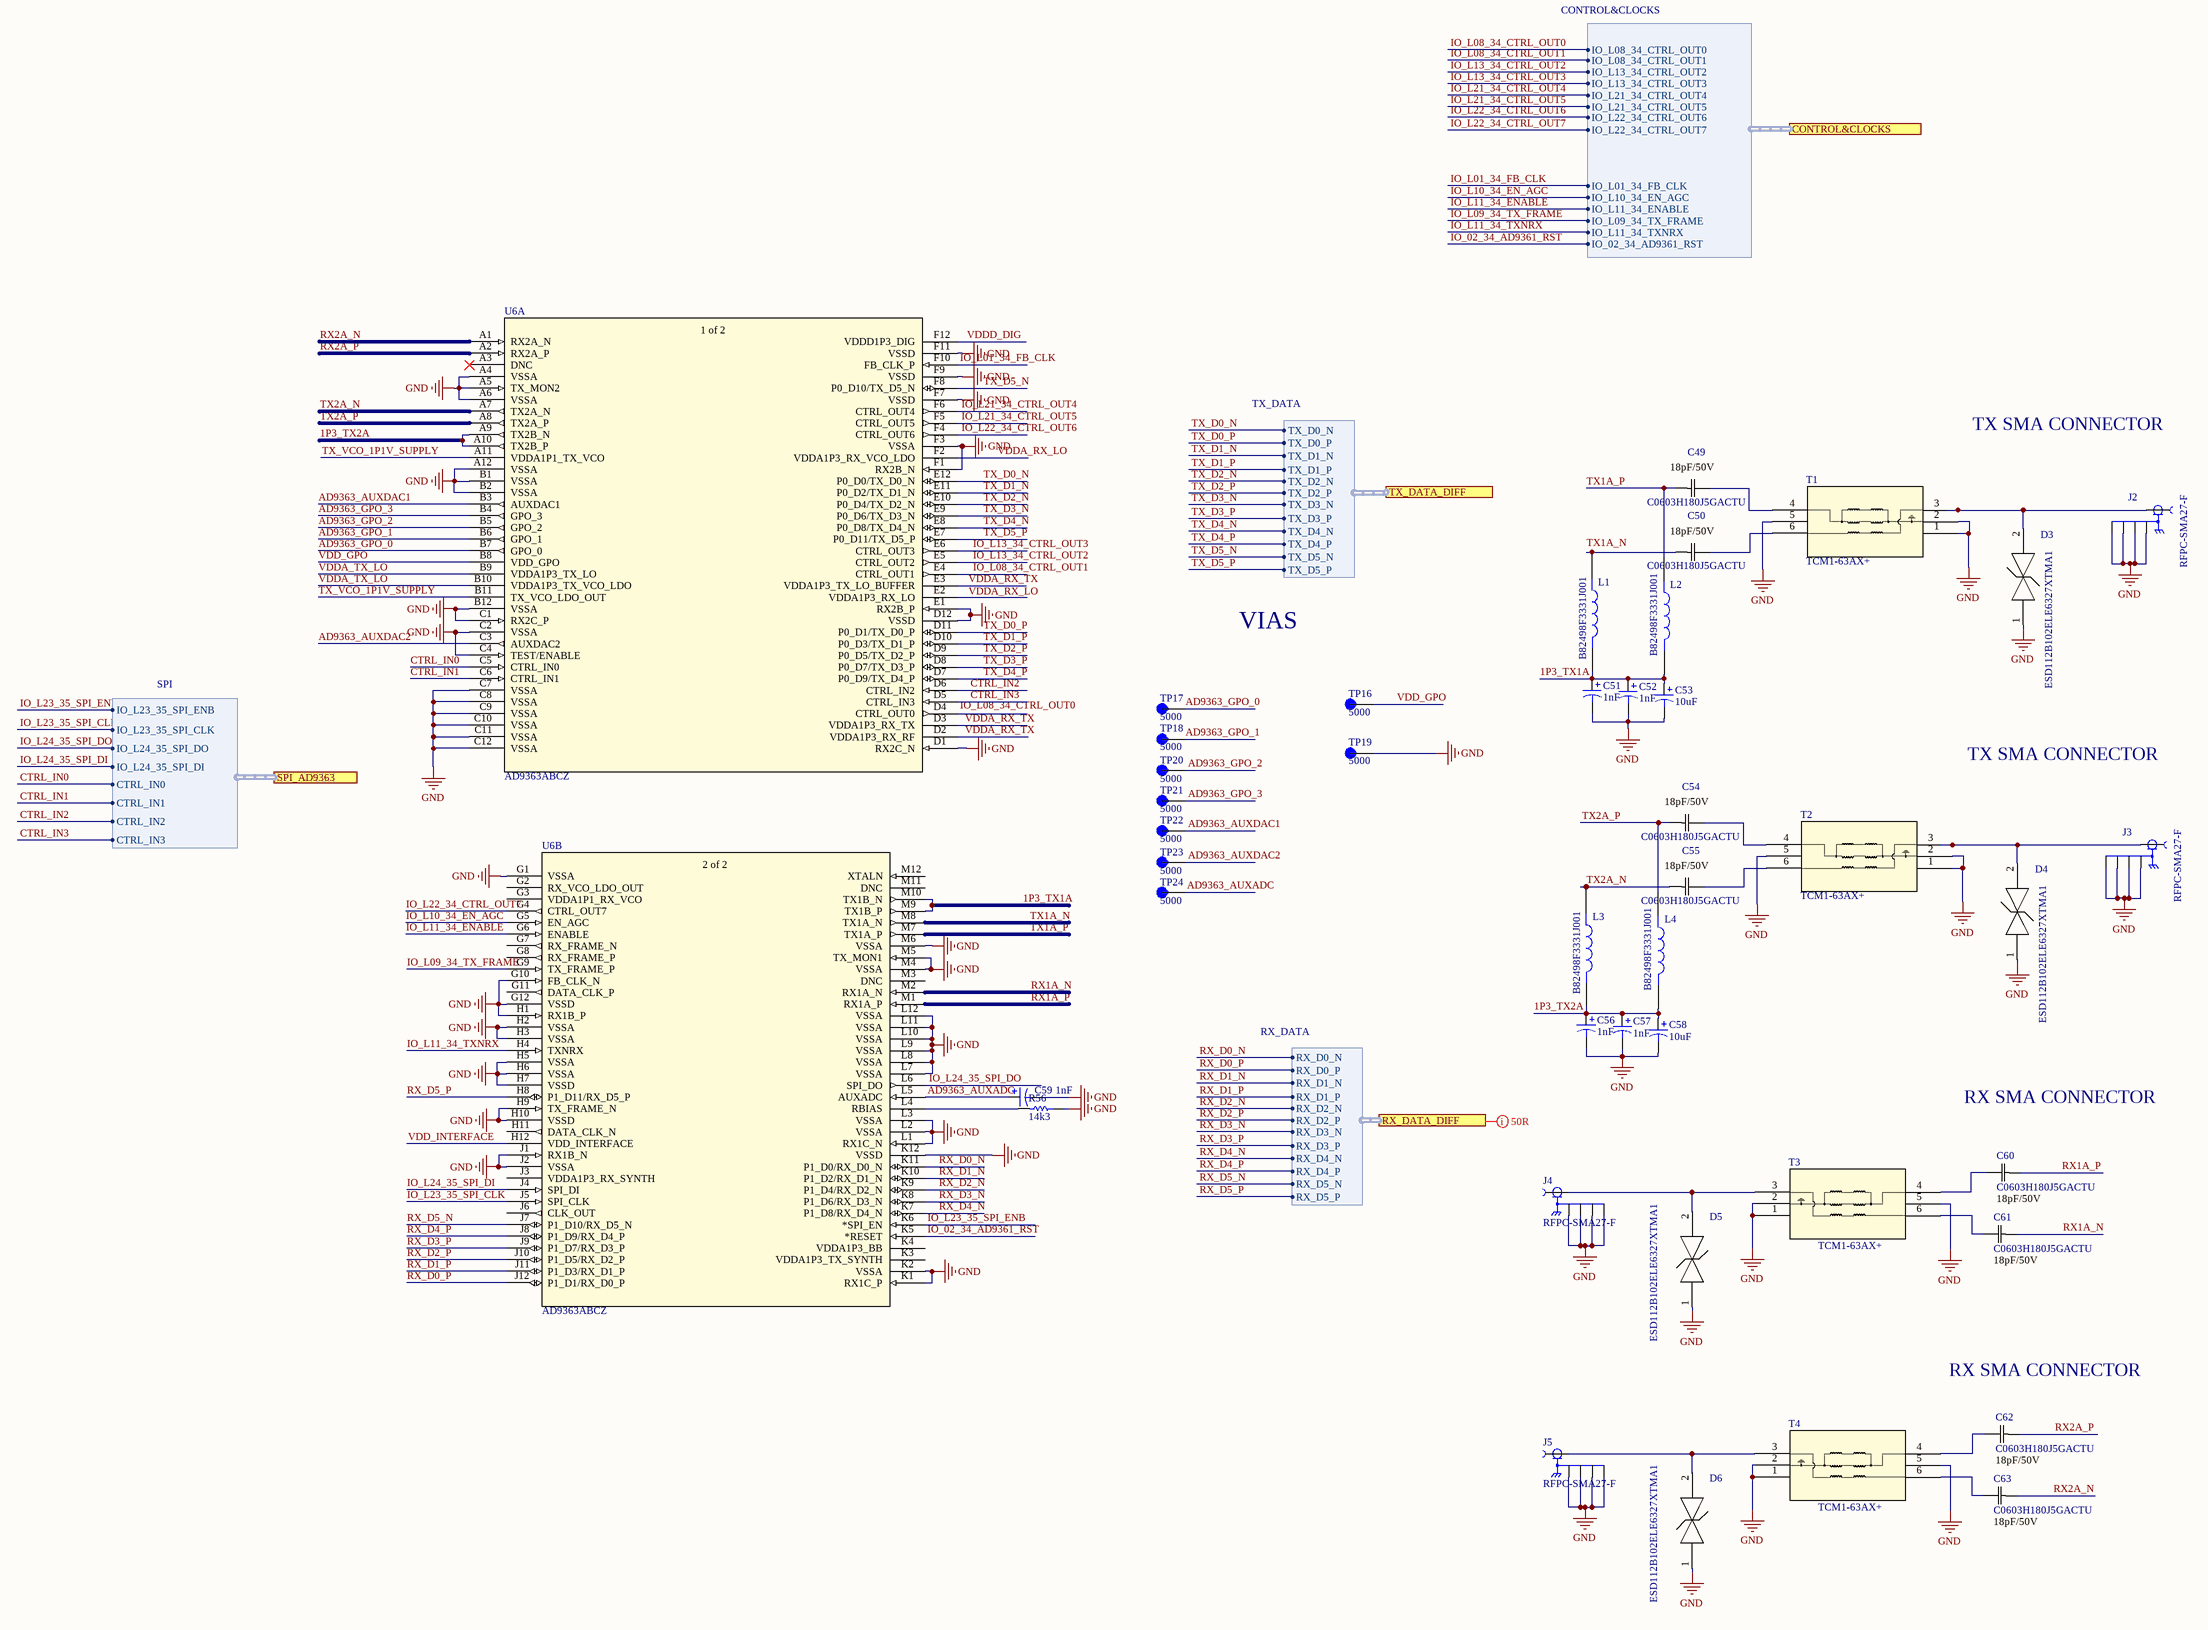
[diagram p6: RF.SchDoc]

### Parts
C49  C0603H180J5GACTU  RefDes: 18pF/50V  [CAPC17595_87N_KEM]
C50  C0603H180J5GACTU  RefDes: 18pF/50V  [CAPC17595_87N_KEM]
C51  value 1nF  [C0805]  (hidden comment: Cap Pol3)
C52  value 1nF  [C0805]  (hidden comment: Cap Pol3)
C53  value 10uF  [C0805]  (hidden comment: Cap Pol3)
C54  C0603H180J5GACTU  RefDes: 18pF/50V  [CAPC17595_87N_KEM]
C55  C0603H180J5GACTU  RefDes: 18pF/50V  [CAPC17595_87N_KEM]
C56  value 1nF  [C0805]  (hidden comment: Cap Pol3)
C57  value 1nF  [C0805]  (hidden comment: Cap Pol3)
C58  value 10uF  [C0805]  (hidden comment: Cap Pol3)
C59  value 1nF  [C0805]  (hidden comment: Cap Pol3)
C60  C0603H180J5GACTU  RefDes: 18pF/50V  [CAPC17595_87N_KEM]
C61  C0603H180J5GACTU  RefDes: 18pF/50V  [CAPC17595_87N_KEM]
C62  C0603H180J5GACTU  RefDes: 18pF/50V  [CAPC17595_87N_KEM]
C63  C0603H180J5GACTU  RefDes: 18pF/50V  [CAPC17595_87N_KEM]
D3  ESD112B102ELE6327XTMA1  [DIODFN100X60X43-2N]
D4  ESD112B102ELE6327XTMA1  [DIODFN100X60X43-2N]
D5  ESD112B102ELE6327XTMA1  [DIODFN100X60X43-2N]
D6  ESD112B102ELE6327XTMA1  [DIODFN100X60X43-2N]
J2  RFPC-SMA27-F  [GRADCONN_RFPC-SMA27-F]
J3  RFPC-SMA27-F  [GRADCONN_RFPC-SMA27-F]
J4  RFPC-SMA27-F  [GRADCONN_RFPC-SMA27-F]
J5  RFPC-SMA27-F  [GRADCONN_RFPC-SMA27-F]
L1  B82498F3331J001  [IND_B82498F3331J001]
L2  B82498F3331J001  [IND_B82498F3331J001]
L3  B82498F3331J001  [IND_B82498F3331J001]
L4  B82498F3331J001  [IND_B82498F3331J001]
R56  value 14k3  [0603]  (hidden comment: Res1)
T1  TCM1-63AX+  [DB1627_MNC]
T2  TCM1-63AX+  [DB1627_MNC]
T3  TCM1-63AX+  [DB1627_MNC]
T4  TCM1-63AX+  [DB1627_MNC]
TP16  5000  [KEYSTONE_5000]
TP17  5000  [KEYSTONE_5000]
TP18  5000  [KEYSTONE_5000]
TP19  5000  [KEYSTONE_5000]
TP20  5000  [KEYSTONE_5000]
TP21  5000  [KEYSTONE_5000]
TP22  5000  [KEYSTONE_5000]
TP23  5000  [KEYSTONE_5000]
TP24  5000  [KEYSTONE_5000]
U6  AD9363ABCZ  [BC-144-7_ADI]  (parts A,B of 2)

### Ports
CONTROL&CLOCKS (harness CONTROL&CLOCKS), RX_DATA_DIFF (harness RX_DATA), SPI_AD9363 (harness SPI), TX_DATA_DIFF (harness TX_DATA)

### Harnesses
RX_DATA: RX_D0_P, RX_D0_N, RX_D1_N, RX_D1_P, RX_D2_P, RX_D2_N, RX_D3_N, RX_D3_P, RX_D4_P, RX_D5_N, RX_D5_P, RX_D4_N
SPI: IO_L24_35_SPI_DO, IO_L24_35_SPI_DI, IO_L23_35_SPI_CLK, IO_L23_35_SPI_ENB, CTRL_IN0, CTRL_IN1, CTRL_IN2, CTRL_IN3
CONTROL&CLOCKS: IO_L08_34_CTRL_OUT1, IO_L13_34_CTRL_OUT2, IO_L13_34_CTRL_OUT3, IO_L21_34_CTRL_OUT4, IO_L21_34_CTRL_OUT5, IO_L22_34_CTRL_OUT6, IO_L22_34_CTRL_OUT7, IO_L01_34_FB_CLK, IO_L10_34_EN_AGC, IO_L11_34_ENABLE, IO_L09_34_TX_FRAME, IO_L11_34_TXNRX, IO_02_34_AD9361_RST, IO_L08_34_CTRL_OUT0
TX_DATA: TX_D0_P, TX_D0_N, TX_D1_N, TX_D1_P, TX_D2_P, TX_D2_N, TX_D3_N, TX_D3_P, TX_D4_P, TX_D4_N, TX_D5_N, TX_D5_P

### Nets
GND: C51.2 C52.2 C53.2 C56.2 C57.2 C58.2 C59.2 J2.G1 J2.G2 J2.G3 J2.G4 J3.G1 J3.G2 J3.G3 J3.G4 J4.G1 J4.G2 J4.G3 J4.G4 J5.G1 J5.G2 J5.G3 J5.G4 R56.1 T1.1 T1.2 T1.5 T2.1 T2.2 T2.5 T3.1 T3.2 T3.5 T4.1 T4.2 T4.5 TP19.TP U6.A4(VSSA) U6.A5(TX_MON2) U6.A6(VSSA) U6.A12(VSSA) U6.B1(VSSA) U6.B2(VSSA) U6.B12(VSSA) U6.C1(RX2C_P) U6.C2(VSSA) U6.C4(TEST/ENABLE) U6.C7(VSSA) U6.C8(VSSA) U6.C9(VSSA) U6.C10(VSSA) U6.C11(VSSA) U6.C12(VSSA) U6.D1(RX2C_N) U6.D12(VSSD) U6.E1(RX2B_P) U6.F1(RX2B_N) U6.F3(VSSA) U6.F7(VSSD) U6.F9(VSSD) U6.F11(VSSD) U6.G1(VSSA) U6.G10(FB_CLK_N) U6.G12(VSSD) U6.H1(RX1B_P) U6.H2(VSSA) U6.H3(VSSA) U6.H5(VSSA) U6.H6(VSSA) U6.H7(VSSD) U6.H9(TX_FRAME_N) U6.H10(VSSD) U6.J1(RX1B_N) U6.J2(VSSA) U6.K1(RX1C_P) U6.K2(VSSA) U6.K12(VSSD) U6.L1(RX1C_N) U6.L2(VSSA) U6.L3(VSSA) U6.L7(VSSA) U6.L8(VSSA) U6.L9(VSSA) U6.L10(VSSA) U6.L11(VSSA) U6.L12(VSSA) U6.M4(VSSA) U6.M5(TX_MON1) U6.M6(VSSA)
1P3_TX1A: C51.1 C52.1 C53.1 L1.1 L2.1 U6.M9(TX1B_P) U6.M10(TX1B_N)
1P3_TX2A: C56.1 C57.1 C58.1 L3.1 L4.1 U6.A9(TX2B_N) U6.A10(TX2B_P)
AD9363_AUXADC: C59.1 TP24.TP U6.L5(AUXADC)
AD9363_AUXDAC1: TP22.TP U6.B3(AUXDAC1)
AD9363_AUXDAC2: TP23.TP U6.C3(AUXDAC2)
AD9363_GPO_0: TP17.TP U6.B7(GPO_0)
AD9363_GPO_1: TP18.TP U6.B6(GPO_1)
AD9363_GPO_2: TP20.TP U6.B5(GPO_2)
AD9363_GPO_3: TP21.TP U6.B4(GPO_3)
CTRL_IN0: U6.C5(CTRL_IN0) ; port SPI_AD9363.CTRL_IN0
CTRL_IN1: U6.C6(CTRL_IN1) ; port SPI_AD9363.CTRL_IN1
CTRL_IN2: U6.D6(CTRL_IN2) ; port SPI_AD9363.CTRL_IN2
CTRL_IN3: U6.D5(CTRL_IN3) ; port SPI_AD9363.CTRL_IN3
IO_02_34_AD9361_RST: U6.K5(*RESET) ; port CONTROL&CLOCKS.IO_02_34_AD9361_RST  [project net CONTROL&CLOCKS.IO_02_34_AD9361_RST]
IO_L01_34_FB_CLK: U6.F10(FB_CLK_P) ; port CONTROL&CLOCKS.IO_L01_34_FB_CLK  [project net CONTROL&CLOCKS.IO_L01_34_FB_CLK]
IO_L08_34_CTRL_OUT1: U6.E4(CTRL_OUT1) ; port CONTROL&CLOCKS.IO_L08_34_CTRL_OUT1  [project net CONTROL&CLOCKS.IO_L08_34_CTRL_OUT1]
IO_L09_34_TX_FRAME: U6.G9(TX_FRAME_P) ; port CONTROL&CLOCKS.IO_L09_34_TX_FRAME  [project net CONTROL&CLOCKS.IO_L09_34_TX_FRAME]
IO_L10_34_EN_AGC: U6.G5(EN_AGC) ; port CONTROL&CLOCKS.IO_L10_34_EN_AGC  [project net CONTROL&CLOCKS.IO_L10_34_EN_AGC]
IO_L11_34_ENABLE: U6.G6(ENABLE) ; port CONTROL&CLOCKS.IO_L11_34_ENABLE  [project net CONTROL&CLOCKS.IO_L11_34_ENABLE]
IO_L11_34_TXNRX: U6.H4(TXNRX) ; port CONTROL&CLOCKS.IO_L11_34_TXNRX  [project net CONTROL&CLOCKS.IO_L11_34_TXNRX]
IO_L13_34_CTRL_OUT2: U6.E5(CTRL_OUT2) ; port CONTROL&CLOCKS.IO_L13_34_CTRL_OUT2  [project net CONTROL&CLOCKS.IO_L13_34_CTRL_OUT2]
IO_L13_34_CTRL_OUT3: U6.E6(CTRL_OUT3) ; port CONTROL&CLOCKS.IO_L13_34_CTRL_OUT3  [project net CONTROL&CLOCKS.IO_L13_34_CTRL_OUT3]
IO_L21_34_CTRL_OUT4: U6.F6(CTRL_OUT4) ; port CONTROL&CLOCKS.IO_L21_34_CTRL_OUT4  [project net CONTROL&CLOCKS.IO_L21_34_CTRL_OUT4]
IO_L21_34_CTRL_OUT5: U6.F5(CTRL_OUT5) ; port CONTROL&CLOCKS.IO_L21_34_CTRL_OUT5  [project net CONTROL&CLOCKS.IO_L21_34_CTRL_OUT5]
IO_L22_34_CTRL_OUT6: U6.F4(CTRL_OUT6) ; port CONTROL&CLOCKS.IO_L22_34_CTRL_OUT6  [project net CONTROL&CLOCKS.IO_L22_34_CTRL_OUT6]
IO_L22_34_CTRL_OUT7: U6.G4(CTRL_OUT7) ; port CONTROL&CLOCKS.IO_L22_34_CTRL_OUT7  [project net CONTROL&CLOCKS.IO_L22_34_CTRL_OUT7]
IO_L23_35_SPI_CLK: U6.J5(SPI_CLK) ; port SPI_AD9363.IO_L23_35_SPI_CLK
IO_L23_35_SPI_ENB: U6.K6(*SPI_EN) ; port SPI_AD9363.IO_L23_35_SPI_ENB
IO_L24_35_SPI_DI: U6.J4(SPI_DI) ; port SPI_AD9363.IO_L24_35_SPI_DI
IO_L24_35_SPI_DO: U6.L6(SPI_DO) ; port SPI_AD9363.IO_L24_35_SPI_DO
RX1A_N: C61.1 U6.M2(RX1A_N)
RX1A_P: C60.1 U6.M1(RX1A_P)
RX2A_N: C63.1 U6.A1(RX2A_N)
RX2A_P: C62.1 U6.A2(RX2A_P)
RX_D0_N: U6.K11(P1_D0/RX_D0_N) ; port RX_DATA_DIFF.RX_D0_N
RX_D0_P: U6.J12(P1_D1/RX_D0_P) ; port RX_DATA_DIFF.RX_D0_P
RX_D1_N: U6.K10(P1_D2/RX_D1_N) ; port RX_DATA_DIFF.RX_D1_N
RX_D1_P: U6.J11(P1_D3/RX_D1_P) ; port RX_DATA_DIFF.RX_D1_P
RX_D2_N: U6.K9(P1_D4/RX_D2_N) ; port RX_DATA_DIFF.RX_D2_N
RX_D2_P: U6.J10(P1_D5/RX_D2_P) ; port RX_DATA_DIFF.RX_D2_P
RX_D3_N: U6.K8(P1_D6/RX_D3_N) ; port RX_DATA_DIFF.RX_D3_N
RX_D3_P: U6.J9(P1_D7/RX_D3_P) ; port RX_DATA_DIFF.RX_D3_P
RX_D4_N: U6.K7(P1_D8/RX_D4_N) ; port RX_DATA_DIFF.RX_D4_N
RX_D4_P: U6.J8(P1_D9/RX_D4_P) ; port RX_DATA_DIFF.RX_D4_P
RX_D5_N: U6.J7(P1_D10/RX_D5_N) ; port RX_DATA_DIFF.RX_D5_N
RX_D5_P: U6.H8(P1_D11/RX_D5_P) ; port RX_DATA_DIFF.RX_D5_P
TX1A_N: U6.M8(TX1A_N)
TX1A_P: C49.1 L2.2 U6.M7(TX1A_P)
TX2A_N: C55.1 L3.2 U6.A7(TX2A_N)
TX2A_P: C54.1 L4.2 U6.A8(TX2A_P)
TX_D0_N: U6.E12(P0_D0/TX_D0_N) ; port TX_DATA_DIFF.TX_D0_N
TX_D0_P: U6.D11(P0_D1/TX_D0_P) ; port TX_DATA_DIFF.TX_D0_P
TX_D1_N: U6.E11(P0_D2/TX_D1_N) ; port TX_DATA_DIFF.TX_D1_N
TX_D1_P: U6.D10(P0_D3/TX_D1_P) ; port TX_DATA_DIFF.TX_D1_P
TX_D2_N: U6.E10(P0_D4/TX_D2_N) ; port TX_DATA_DIFF.TX_D2_N
TX_D2_P: U6.D9(P0_D5/TX_D2_P) ; port TX_DATA_DIFF.TX_D2_P
TX_D3_N: U6.E9(P0_D6/TX_D3_N) ; port TX_DATA_DIFF.TX_D3_N
TX_D3_P: U6.D8(P0_D7/TX_D3_P) ; port TX_DATA_DIFF.TX_D3_P
TX_D4_N: U6.E8(P0_D8/TX_D4_N) ; port TX_DATA_DIFF.TX_D4_N
TX_D4_P: U6.D7(P0_D9/TX_D4_P) ; port TX_DATA_DIFF.TX_D4_P
TX_D5_N: U6.F8(P0_D10/TX_D5_N) ; port TX_DATA_DIFF.TX_D5_N
TX_D5_P: U6.E7(P0_D11/TX_D5_P) ; port TX_DATA_DIFF.TX_D5_P
TX_VCO_1P1V_SUPPLY: U6.A11(VDDA1P1_TX_VCO) U6.B11(TX_VCO_LDO_OUT)
VDD_GPO: TP16.TP U6.B8(VDD_GPO)
VDD_INTERFACE: U6.H12(VDD_INTERFACE)
VDDA_RX_LO: U6.F2(VDDA1P3_RX_VCO_LDO)
VDDA_RX_TX: U6.D2(VDDA1P3_RX_RF) U6.D3(VDDA1P3_RX_TX) U6.E3(VDDA1P3_TX_LO_BUFFER)
VDDA_TX_LO: U6.B9(VDDA1P3_TX_LO) U6.B10(VDDA1P3_TX_VCO_LDO)
VDDD_DIG: U6.F12(VDDD1P3_DIG)
NetC49_2: C49.2 T1.4
NetC50_1: C50.1 L1.2
NetC50_2: C50.2 T1.6
NetC54_2: C54.2 T2.4
NetC55_2: C55.2 T2.6
NetC60_2: C60.2 T3.4
NetC61_2: C61.2 T3.6
NetC62_2: C62.2 T4.4
NetC63_2: C63.2 T4.6
NetJ2_1: J2.1 T1.3
NetJ3_1: J3.1 T2.3
NetJ4_1: J4.1 T3.3
NetJ5_1: J5.1 T4.3
NetR56_2: R56.2 U6.L4(RBIAS)

Not connected (* = marked no-connect by the designer): D3 1 2; D4 1 2; D5 1 2; D6 1 2; U6 A3(DNC)* D4(CTRL_OUT0) E2(VDDA1P3_RX_LO) G2(RX_VCO_LDO_OUT) G3(VDDA1P1_RX_VCO) G7(RX_FRAME_N) G8(RX_FRAME_P) G11(DATA_CLK_P) H11(DATA_CLK_N) J3(VDDA1P3_RX_SYNTH) J6(CLK_OUT) K3(VDDA1P3_TX_SYNTH) K4(VDDA1P3_BB) M3(DNC) M11(DNC) M12(XTALN)

### Layout directives
mark named 50R: (no net found under the mark)

### Notes on the sheet
- TX SMA CONNECTOR
- VIAS
- RX SMA CONNECTOR
- Labels drawn without touching a wire or pin: IO_L08_34_CTRL_OUT0, TX1A_N, VDDA_RX_LO
- (in symbol AD9363ABCZ, part A) 1 of 2
- (in symbol AD9363ABCZ, part B) 2 of 2

### Library data of the parts
C49 C50 C54 C55 C60-C63 = C0603H180J5GACTU: No Description Available; Mfr_Name: Kemet
C51-C53 C56-C59 = Cap Pol3: Polarized Capacitor (Surface Mount); Published: 8-Jun-2000; LatestRevisionDate: 29-May-2009; LatestRevisionNote: IPC-7351 Footprint Added.; PackageReference: C0805; Publisher: Altium Limited; PackageDescription: Chip Capacitor
D3-D6 = ESD112B102ELE6327XTMA1: TVS RF PLUTO
J2-J5 = RFPC-SMA27-F: MF: {'manufacturer': u'GCT (Gradconn)'}; Package: None; Price: None; Value: *; MP: RFPC-SMA27-F; Availability: Unavailable
L1-L4 = B82498F3331J001: MF: TDK; SnapEDA_Link: https://www.snapeda.com/parts/B82498F3331J001/TDK/view-part/?ref=snap; Availability: In Stock; Value: *; Check_prices: https://www.snapeda.com/parts/B82498F3331J001/TDK/view-part/?ref=eda; Purchase-URL: https://pricing.snapeda.com/search/part/B82498F3331J001/?ref=eda; Package: None; Price: None; MP: B82498F3331J001
R56 = Res1_1: as R1 on sheet ZynQ7xxx; Published: 8-Jun-2000; Revision: July-2002: Re-released for DXP Platform.; Publisher: Altium Limited; Class II: Resistor; REF FARNELL 1206 SMD 510R: 4387065; REF FARNELL 1206 SMD 1K: 912475; REF FARNELL 1206 SMD 10K: 912591; REF FARNELL 0603 SMD: 612-595
T1-T4 = TCM1-63AX+: No Description Available; Mfr_Name: Mini Circuits; RefDes: RefDes; Type: Type
TP16-TP24 = 5000: as TP1 on sheet ZynQ7xxx; SnapEDA_Link: https://www.snapeda.com/parts/5000/Keystone/view-part/?ref=snap; Package: Test Point Keystone Electronics; Value: *; MF: Keystone Electronics; MP: 5000; Check_prices: https://www.snapeda.com/parts/5000/Keystone/view-part/?ref=eda
U6 = AD9363ABCZ: No Description Available; Mfr_Name: Analog Devices Inc; Type: RF; RefDes: RefDes